# Altium project RTTester_CIV.PrjPcb (part 1 of 2)
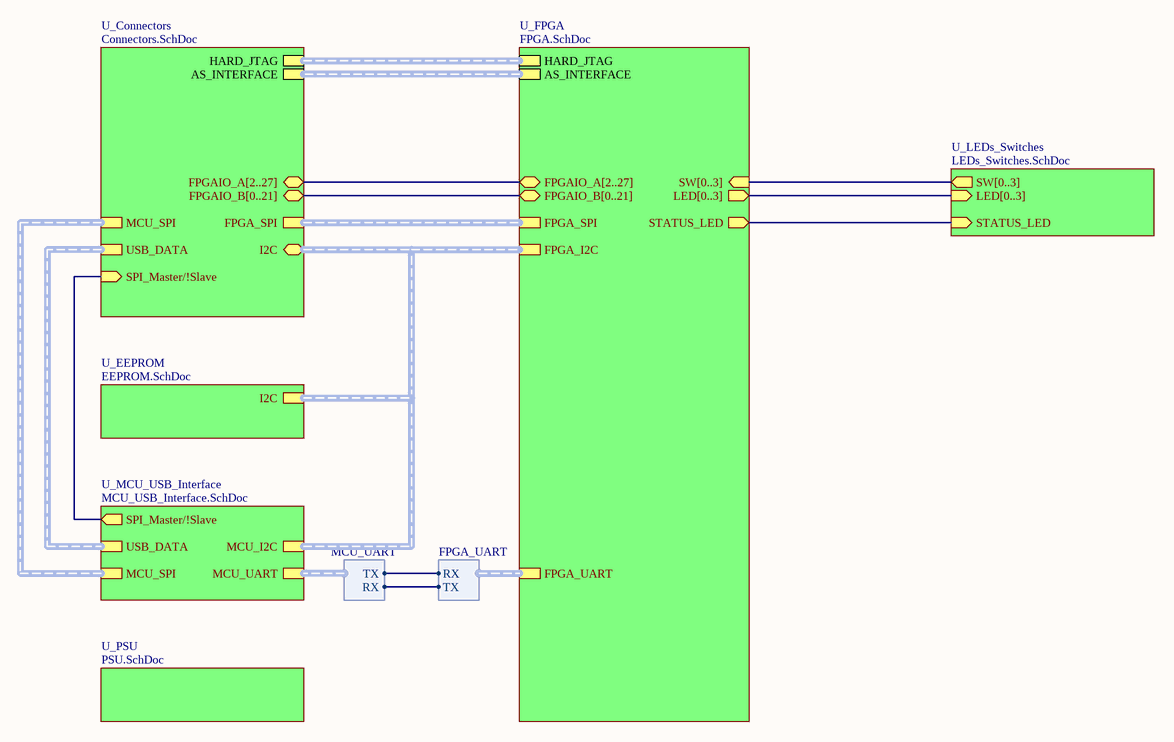
[diagram p0: Top.SchDoc]
18 sheets, 147 parts. Net scope: hierarchical (ports join the sheet entries above them; power ports are global).
Board file: RTTester.PcbDoc
Sheets:
  Top.SchDoc
    U_PSU = PSU.SchDoc
      U_PUS_Decoupling = PUS_Decoupling.SchDoc
      U_PSU_3V3_LD29300 = PSU_3V3_LD29300.SchDoc
      U_PSU_2V5_LDK130 = PSU_2V5_LDK130.SchDoc
      U_PSU_1V2_LD1117A = PSU_1V2_LD1117A.SchDoc
    U_LEDs_Switches = LEDs_Switches.SchDoc
    U_MCU_USB_Interface = MCU_USB_Interface.SchDoc
    U_Connectors = Connectors.SchDoc
      U_Config_Interfaces = Config_Interfaces.SchDoc
      U_MicroSD = MicroSD.SchDoc
    U_FPGA = FPGA.SchDoc
      U_FPGA_Conf = FPGA_Conf.SchDoc
      U_FPGA_CLK = FPGA_CLK.SchDoc
      U_FPGA_Power = FPGA_Power.SchDoc
      U_FPGA_Banks = FPGA_Banks.SchDoc
      U_OSC = OSC.SchDoc
    U_EEPROM = EEPROM.SchDoc

## Sheet Top.SchDoc: TOP
size A4; DocumentNumber: 1; SheetNumber: 1; SheetTotal: 18

### Sub-sheets
U_Connectors = Connectors.SchDoc: HARD_JTAG (harness HARD_JTAG), AS_INTERFACE (harness AS_INTERFACE), FPGAIO_A[2..27] (bidir), FPGAIO_B[0..21] (bidir, harness TEST_INT), USB_DATA (harness USB_DATA), FPGA_SPI (harness FPGA_SPI), MCU_SPI (harness MCU_SPI), I2C (harness I2C), SPI_Master/!Slave (in)
U_EEPROM = EEPROM.SchDoc: I2C (harness I2C)
U_FPGA = FPGA.SchDoc: HARD_JTAG (harness HARD_JTAG), AS_INTERFACE (harness AS_INTERFACE), STATUS_LED (out), FPGA_SPI (harness FPGA_SPI), FPGA_I2C (harness I2C), FPGAIO_A[2..27] (bidir), FPGAIO_B[0..21] (bidir, harness TEST_INT), FPGA_UART (harness FPGA_UART), SW[0..3] (in), LED[0..3] (out)
U_LEDs_Switches = LEDs_Switches.SchDoc: SW[0..3] (out), LED[0..3] (in), STATUS_LED (in)
U_MCU_USB_Interface = MCU_USB_Interface.SchDoc: USB_DATA (harness USB_DATA), MCU_SPI (harness MCU_SPI), MCU_I2C (harness I2C), MCU_UART (harness MCU_UART), SPI_Master/!Slave (out)
U_PSU = PSU.SchDoc: no entries

### Harnesses
MCU_UART: TX, RX
FPGA_UART: TX, RX

### Nets
FPGA_RX: sheet U_MCU_USB_Interface/MCU_UART.TX, sheet U_FPGA/FPGA_UART.RX
FPGA_TX: sheet U_MCU_USB_Interface/MCU_UART.RX, sheet U_FPGA/FPGA_UART.TX
SPI_M/!S: sheet U_MCU_USB_Interface/SPI_Master/!Slave, sheet U_Connectors/SPI_Master/!Slave
NetP8_3: sheet U_LEDs_Switches/STATUS_LED, sheet U_FPGA/STATUS_LED

### Buses and harness runs
bus sheet U_Connectors/FPGAIO_A[2..27] = sheet U_FPGA/FPGAIO_A[2..27]
bus sheet U_FPGA/LED[0..3] = sheet U_LEDs_Switches/LED[0..3]
bus sheet U_FPGA/SW[0..3] = sheet U_LEDs_Switches/SW[0..3]
harness sheet U_Connectors/AS_INTERFACE = sheet U_FPGA/AS_INTERFACE
harness sheet U_Connectors/FPGA_SPI = sheet U_FPGA/FPGA_SPI
harness sheet U_Connectors/HARD_JTAG = sheet U_FPGA/HARD_JTAG
harness sheet U_Connectors/I2C = sheet U_EEPROM/I2C = sheet U_FPGA/FPGA_I2C = sheet U_MCU_USB_Interface/MCU_I2C
harness sheet U_Connectors/MCU_SPI = sheet U_MCU_USB_Interface/MCU_SPI
harness sheet U_Connectors/USB_DATA = sheet U_MCU_USB_Interface/USB_DATA

### Notes on the sheet
- Title
- Size:
- Date:
- A4
- Number:
- Time:
- Revision:
- Sheet
- of
- File:

## Sheet PSU.SchDoc: PSU TOP
size A4; DocumentNumber: 14; SheetNumber: 14; SheetTotal: 18
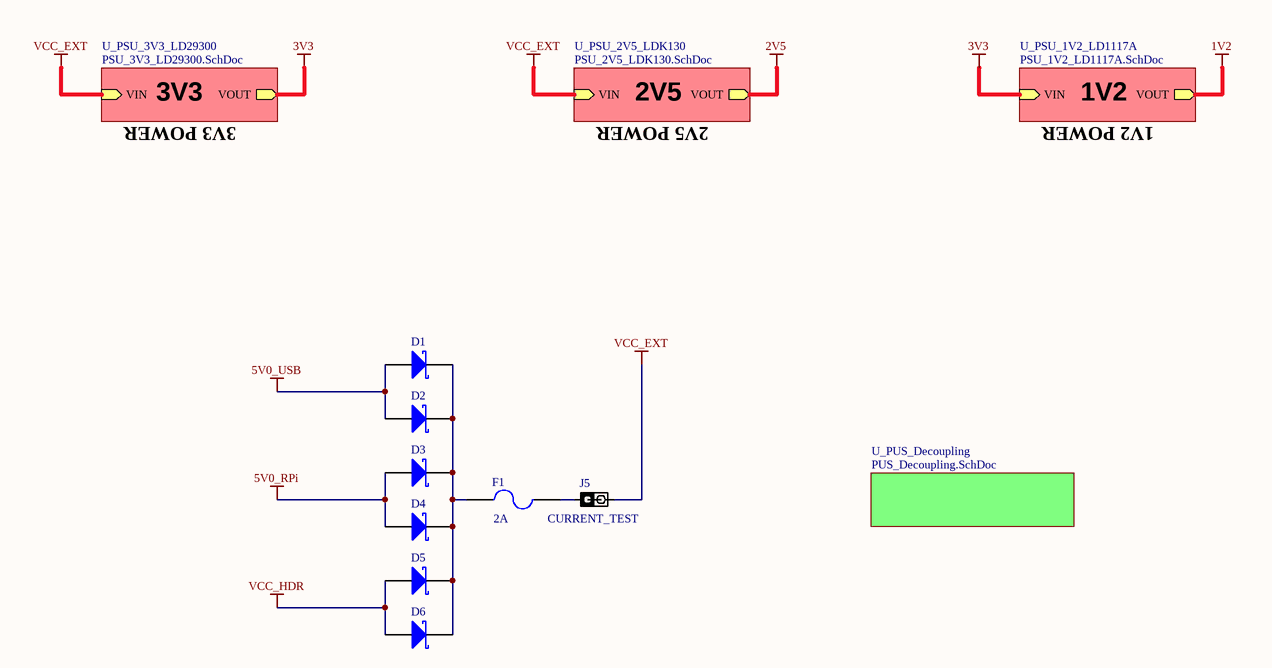
[diagram p1: PSU.SchDoc]

### Parts
D1  D Schottky  [LED-0805-K]  (value not drawn)
D2  D Schottky  [LED-0805-K]  (value not drawn)
D3  D Schottky  [LED-0805-K]  (value not drawn)
D4  D Schottky  [LED-0805-K]  (value not drawn)
D5  D Schottky  [LED-0805-K]  (value not drawn)
D6  D Schottky  [LED-0805-K]  (value not drawn)
F1  Hold Current: 2A  [1812]  (hidden comment: Polyfuse_1812L200THPR)
J5  JMPR2  [JMPR2-CLOSED]  (value not drawn)

### Sub-sheets
U_PSU_1V2_LD1117A = PSU_1V2_LD1117A.SchDoc: VIN (in), VOUT (out)
U_PSU_2V5_LDK130 = PSU_2V5_LDK130.SchDoc: VIN (in), VOUT (out)
U_PSU_3V3_LD29300 = PSU_3V3_LD29300.SchDoc: VIN (in), VOUT (out)
U_PUS_Decoupling = PUS_Decoupling.SchDoc: no entries

### Nets
3V3: sheet U_PSU_3V3_LD29300/VOUT, sheet U_PSU_1V2_LD1117A/VIN
5V0_RPi: D3.A D4.A
5V0_USB: D1.A D2.A
VCC_EXT: J5.2 ; sheet U_PSU_3V3_LD29300/VIN, sheet U_PSU_2V5_LDK130/VIN
VCC_HDR: D5.A D6.A
NetD1_K: D1.K D2.K D3.K D4.K D5.K D6.K F1.1
NetF1_2: F1.2 J5.1

### Notes on the sheet
- 3V3
- 3V3 POWER
- 2V5
- 2V5 POWER
- 1V2
- 1V2 POWER
- CURRENT_TEST
- Title
- Size:
- Date:
- A4
- Number:
- Time:
- Revision:
- Sheet
- of
- File:

### Library data of the parts
D1-D6 = D Schottky: Schottky Diode - SD0805S020S1R0; Published: 8-Jun-2000; LatestRevisionDate: 17-Jul-2002; LatestRevisionNote: Re-released for DXP Platform.; PackageReference: SMB; Publisher: Altium Limited; PackageDescription: 0805; Code_JEDEC: 0805
F1 = Fuse 2: Polyfuse; Trip Current: 3.5A; Published: 8-Jun-2000; LatestRevisionDate: 17-Jul-2002; LatestRevisionNote: Re-released for DXP Platform.; PackageReference: PIN-W2/E2.8; Publisher: Altium Limited; PackageDescription: SMD-1812
J5 = JMPR2-CLOSED: JMPR2 CLOSED BY DEFAULT; Manufacturer: Sullins Connector Solutions; Manufacturer Part Number: PBC36SAAN; Supplier 1: Digi-Key; Supplier Part Number 1: S1011E-36-ND; Reel: Closed

## Sheet PUS_Decoupling.SchDoc: PSU_DECOUPLING
size A4; DocumentNumber: 18; SheetNumber: 18; SheetTotal: 18
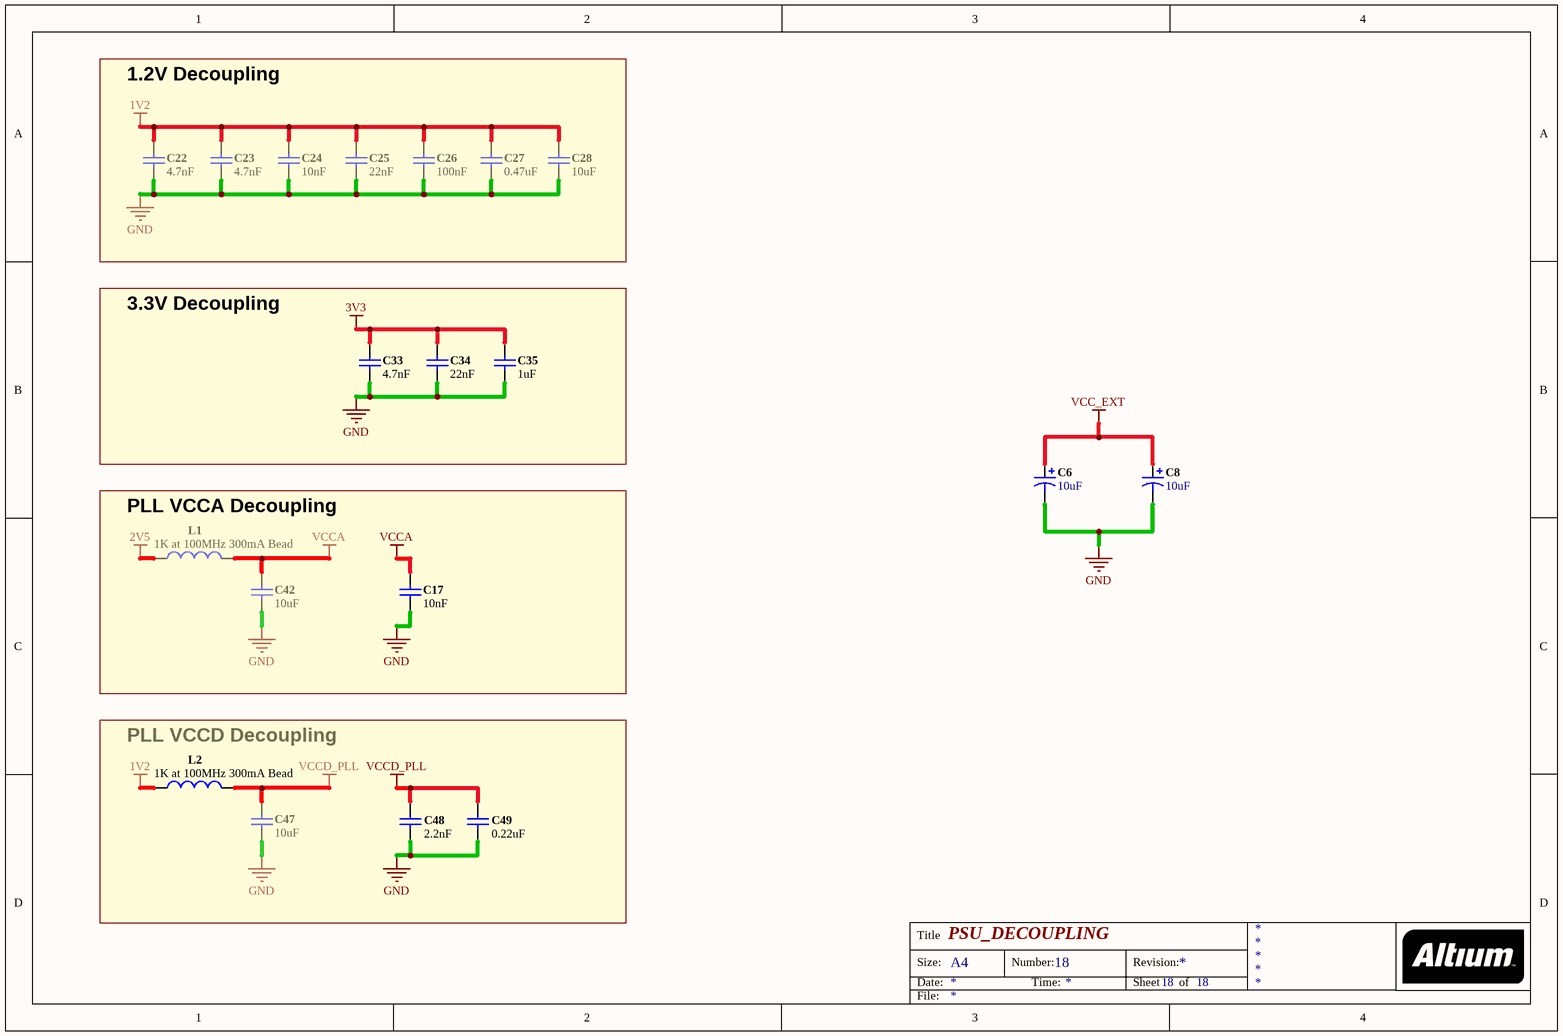
[diagram p2: PUS_Decoupling.SchDoc]

### Parts
C6  10uF  [AVX-CAPC3528_V]
C8  10uF  [AVX-CAPC3528_V]
C17  10nF  [0603C-GENERIC]
C22  4.7nF  [0603C-GENERIC]
C23  4.7nF  [0603C-GENERIC]
C24  10nF  [0603C-GENERIC]
C25  22nF  [0603C-GENERIC]
C26  100nF  [0603C-GENERIC]
C27  0.47uF  [0603C-GENERIC]
C28  10uF  [0603C-GENERIC]
C33  4.7nF  [0603C-GENERIC]
C34  22nF  [0603C-GENERIC]
C35  1uF  [0603C-GENERIC]
C42  10uF  [0805C-GENERIC]
C47  10uF  [0805C-GENERIC]
C48  2.2nF  [0603C-GENERIC]
C49  0.22uF  [0603C-GENERIC]
L1  1K at 100MHz 300mA Bead  [0805FB-1KZ]
L2  1K at 100MHz 300mA Bead  [0805FB-1KZ]

### Blocks framed on the sheet
1.2V Decoupling: C22-C28
3.3V Decoupling: C33-C35
PLL VCCA Decoupling: C17 C42 L1
PLL VCCD Decoupling: C47-C49 L2

### Nets
1V2: C22.1 C23.1 C24.1 C25.1 C26.1 C27.1 C28.1 L2.1
2V5: L1.1
3V3: C33.1 C34.1 C35.1
GND: C6.2 C8.2 C17.1 C22.2 C23.2 C24.2 C25.2 C26.2 C27.2 C28.2 C33.2 C34.2 C35.2 C42.1 C47.1 C48.2 C49.2
VCC_EXT: C6.1 C8.1
VCCA: C17.2 C42.2 L1.2
VCCD_PLL: C47.2 C48.1 C49.1 L2.2

### Notes on the sheet
- Title
- Size:
- Date:
- A4
- Number:
- Time:
- Revision:
- Sheet
- of
- File:

### Library data of the parts
C6 C8 = CMP-0279-00001-1: Capacitor, Tantalum, 10uF 10% 20V MCCT-B (3528); PartNumber: TAJB106K020RNJ; Manufacturer: AVX; Polarity: Polarized; PackageDescription: 2-Pin SMT Capacitor, 3.5 x 2.8 mm Body; ComponentLink1URL: http://www.avx.com/; PackageReference: CAPC3528; ComponentLink2Description: Datasheet; Value: 10uF; Technology: Tantalum; ComponentLink2URL: http://www.avx.com/docs/Catalogs/taj.pdf; Tolerance: 10%; ComponentLink1Description: Manufacturer URL; Rated Voltage: 20V; DatasheetVersion: Jun-13; Mounting Technology: Surface Mount
C17 C22 C23 C33 = CAP 470nF 10V ±10% 0402 (1005 Metric) Thickness 0.6mm SMD: Capacitor, Ceramic, 10% 10V 0603 X7R; Case-Metric: 1005; Case-EIA: 0402; Rated Voltage: 10 V; Max Thickness: 0.6 mm; Technology: SMT; Tolerance: ±10%
  C17: Value: 10nF
  C22 C23 C33: Value: 4.7nF
C24-C27 C34 C35 C48 C49 = CAP 4.7uF 10V ±10% 0603 (1608 Metric) Thickness 0.55mm SMD: Capacitor, Ceramic, 10% 10V 0603 X7R; Case-Metric: 1608; Case-EIA: 0603; Rated Voltage: 10 V; Technology: SMT; Max Thickness: 0.55 mm; Tolerance: ±10%
  C24: Value: 10nF
  C25 C34: Value: 22nF
  C26: Value: 100nF
  C27: Value: 0.47uF
  C35: Value: 1uF
  C48: Value: 2.2nF
  C49: Value: 0.22uF
C28 = CAP 4.7uF 10V ±10% 0603 (1608 Metric) Thickness 0.55mm SMD: Capacitor, Ceramic, 10% 10V 0603 X7R; Case-Metric: 1608; Case-EIA: 0805; Rated Voltage: 10 V; Technology: SMT; Max Thickness: 0.55 mm; Tolerance: ±10%; Value: 10uF
C42 C47 = CAP 470nF 10V ±10% 0402 (1005 Metric) Thickness 0.6mm SMD: Capacitor, Ceramic, 10% 10V 0805 X7R; Case-Metric: 1005; Case-EIA: 0402; Rated Voltage: 10 V; Value: 10uF; Max Thickness: 0.6 mm; Technology: SMT; Tolerance: ±10%
L1 L2 = D-102-0026: Inductor, Ferrite Bead 1K@100MHz 300mA 0805 BK1005HS102-T; Inductance: nH; Max Input Current: 300 mA; Mounting Technology: Surface Mount; Status: Production; Category: Inductor

## Sheet PSU_3V3_LD29300.SchDoc: PSU 3V3
size A4; DocumentNumber: 17; SheetNumber: 17; SheetTotal: 18
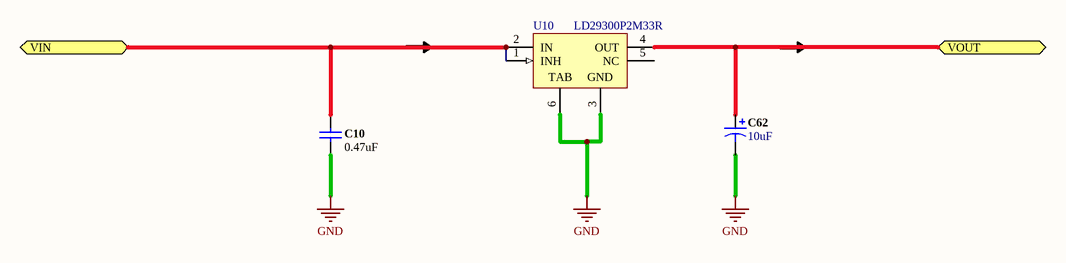
[diagram p3: PSU_3V3_LD29300.SchDoc]

### Parts
C10  0.47uF  [0805C-GENERIC]
C62  10uF  [AVX-CAPC3528_V]
U10  LD29300P2M33R  [P2PAK/A_N]

### Ports
VIN, VOUT

### Nets
3V3: C62.1 U10.4(OUT) ; port VOUT
GND: C10.2 C62.2 U10.3(GND) U10.6(TAB)
VCC_EXT: C10.1 U10.1(INH) U10.2(IN) ; port VIN

Not connected (* = marked no-connect by the designer): U10 5(NC)

### Notes on the sheet
- Title
- Size:
- Date:
- A4
- Number:
- Time:
- Revision:
- Sheet
- of
- File:

### Library data of the parts
C10 = D-101-0027: Capacitor, Ceramic, 10% 10V 0805 X7R; Polarity: Non-Polarized; Capacitance: 0.47uF; Dielectric: X7R; Mounting Technology: Surface Mount; Rated Voltage: 10 V; Status: Production; Technology: Ceramic; Tolerance: 10 %; Category: Capacitor
C62 = CMP-0279-00001-1: Capacitor, Tantalum, 10uF 10% 20V MCCT-B (3528) - TAJB106K020RNJ; Manufacturer: AVX; Polarity: Polarized; PartNumber: TAJB106K020RNJ; PackageDescription: 2-Pin SMT Capacitor, 3.5 x 2.8 mm Body; ComponentLink1URL: http://www.avx.com/; PackageReference: CAPC3528; ComponentLink2Description: Datasheet; Value: 10uF; Technology: Tantalum; ComponentLink2URL: http://www.avx.com/docs/Catalogs/taj.pdf; Tolerance: 10%; ComponentLink1Description: Manufacturer URL; Rated Voltage: 20V; DatasheetVersion: Jun-13; Mounting Technology: Surface Mount
U10 = LD29300P2M33R: 3A, Very Low-Drop Voltage Regulators, 3.3V, 6-Pin P2PAK/A; DatasheetVersion: Jul-2008; PackageVersion: 2008; PackageReference: P2PAK/A; PackageDescription: 6-Pin Transistor Outline Package 1.7 mm Pitch, 15.4 mm Lead Span; PartNumber: LD29300P2M33R; ComponentLink1Description: Manufacturer URL; ComponentLink1URL: http://www.st.com; ComponentLink2Description: Datasheet; ComponentLink2URL: http://www.st.com/internet/com/TECHNICAL_RESOURCES/TECHNICAL_LITERATURE/DATASHEET/CD00003208.pdf

## Sheet PSU_2V5_LDK130.SchDoc: PSU 2V5
size A4; DocumentNumber: 16; SheetNumber: 16; SheetTotal: 18
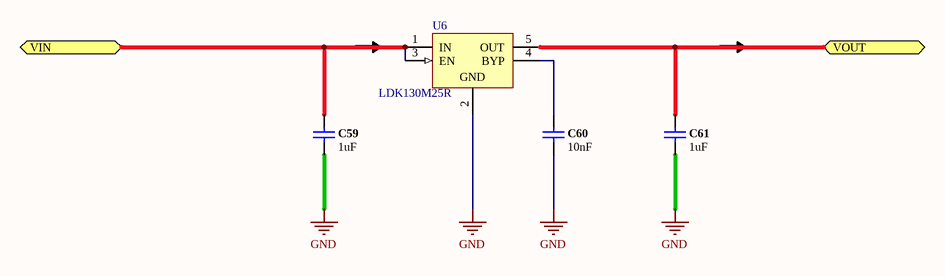
[diagram p4: PSU_2V5_LDK130.SchDoc]

### Parts
C59  1uF  [0805C-GENERIC]
C60  10nF  [0805C-GENERIC]
C61  1uF  [0805C-GENERIC]
U6  LDK130M25R  [SOT23-5L_N]

### Ports
VIN, VOUT

### Nets
2V5: C61.1 U6.5(OUT) ; port VOUT
GND: C59.2 C60.2 C61.2 U6.2(GND)
VCC_EXT: C59.1 U6.1(IN) U6.3(EN) ; port VIN
NetC60_1: C60.1 U6.4(BYP)

### Notes on the sheet
- Title
- Size:
- Date:
- A4
- Number:
- Time:
- Revision:
- Sheet
- of
- File:

### Library data of the parts
C59-C61 = D-101-0027: as C10 on sheet PSU_3V3_LD29300; Dielectric: X7R; Mounting Technology: Surface Mount; Rated Voltage: 10 V; Status: Production; Technology: Ceramic; Tolerance: 10 %; Category: Capacitor
  C59 C61: Capacitance: 1uF
  C60: Capacitance: 10nF
U6 = LD2985BM25R: 300mA, Very-Low Drop and Low Noise Voltage Regulator Low ESR Capacitors Compatible, with Inhibit Function, 2.5V, 5-Pin SOT23-5L; PackageVersion: 2008; PackageReference: SOT23-5L; PackageDescription: 5-Pin SOT-23 Package, 2.9 x 1.6 mm Body, 0.95 mm Pitch, 2.8 mm Lead Span; PartNumber: LDK130M25R; ComponentLink1Description: Manufacturer URL; ComponentLink1URL: http://www.st.com

## Sheet PSU_1V2_LD1117A.SchDoc: PSU 1V2
size A4; DocumentNumber: 15; SheetNumber: 15; SheetTotal: 18
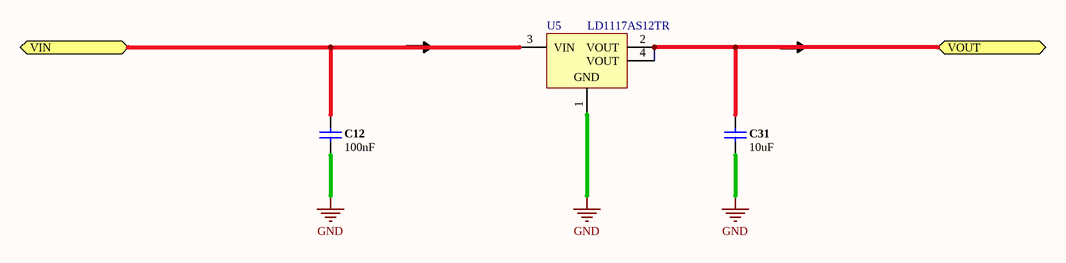
[diagram p5: PSU_1V2_LD1117A.SchDoc]

### Parts
C12  100nF  [0805C-GENERIC]
C31  10uF  [0805C-GENERIC]
U5  LD1117AS12TR  [SOT-223_N]

### Ports
VIN, VOUT

### Nets
1V2: C31.1 U5.2(VOUT) U5.4(VOUT) ; port VOUT
3V3: C12.1 U5.3(VIN) ; port VIN
GND: C12.2 C31.2 U5.1(GND)

### Notes on the sheet
- Title
- Size:
- Date:
- A4
- Number:
- Time:
- Revision:
- Sheet
- of
- File:

### Library data of the parts
C12 = D-101-0027: Capacitor, Ceramic, 10% 10V 0603 X7R; Polarity: Non-Polarized; Capacitance: 100nF; Dielectric: X7R; Mounting Technology: Surface Mount; Rated Voltage: 10 V; Status: Production; Technology: Ceramic; Tolerance: 10 %; Category: Capacitor
C31 = D-101-0027: as C10 on sheet PSU_3V3_LD29300; Capacitance: 10uF; Dielectric: X7R; Mounting Technology: Surface Mount; Rated Voltage: 10 V; Status: Production; Technology: Ceramic; Tolerance: 10 %; Category: Capacitor
U5 = LD1117AS12TR: 1A, Low Drop Positive Voltage Regulator, 1.2V, 4-Pin SOT-223, Tape and Reel; DatasheetVersion: Dec-2011; PackageVersion: 2010; PackageReference: SOT-223; PackageDescription: 4-Pin SOT-223 Package, 6.5 x 3.5 mm Body, 2.3 mm Pitch, 7 mm Lead Span; PartNumber: LD1117AS12TR; ComponentLink1Description: Manufacturer URL; ComponentLink1URL: http://www.st.com; ComponentLink2Description: Datasheet; ComponentLink2URL: http://www.st.com/internet/com/TECHNICAL_RESOURCES/TECHNICAL_LITERATURE/DATASHEET/CD00002116.pdf

## Sheet LEDs_Switches.SchDoc: LEDs AND SWITCHES
size A4; DocumentNumber: 12; SheetNumber: 12; SheetTotal: 18
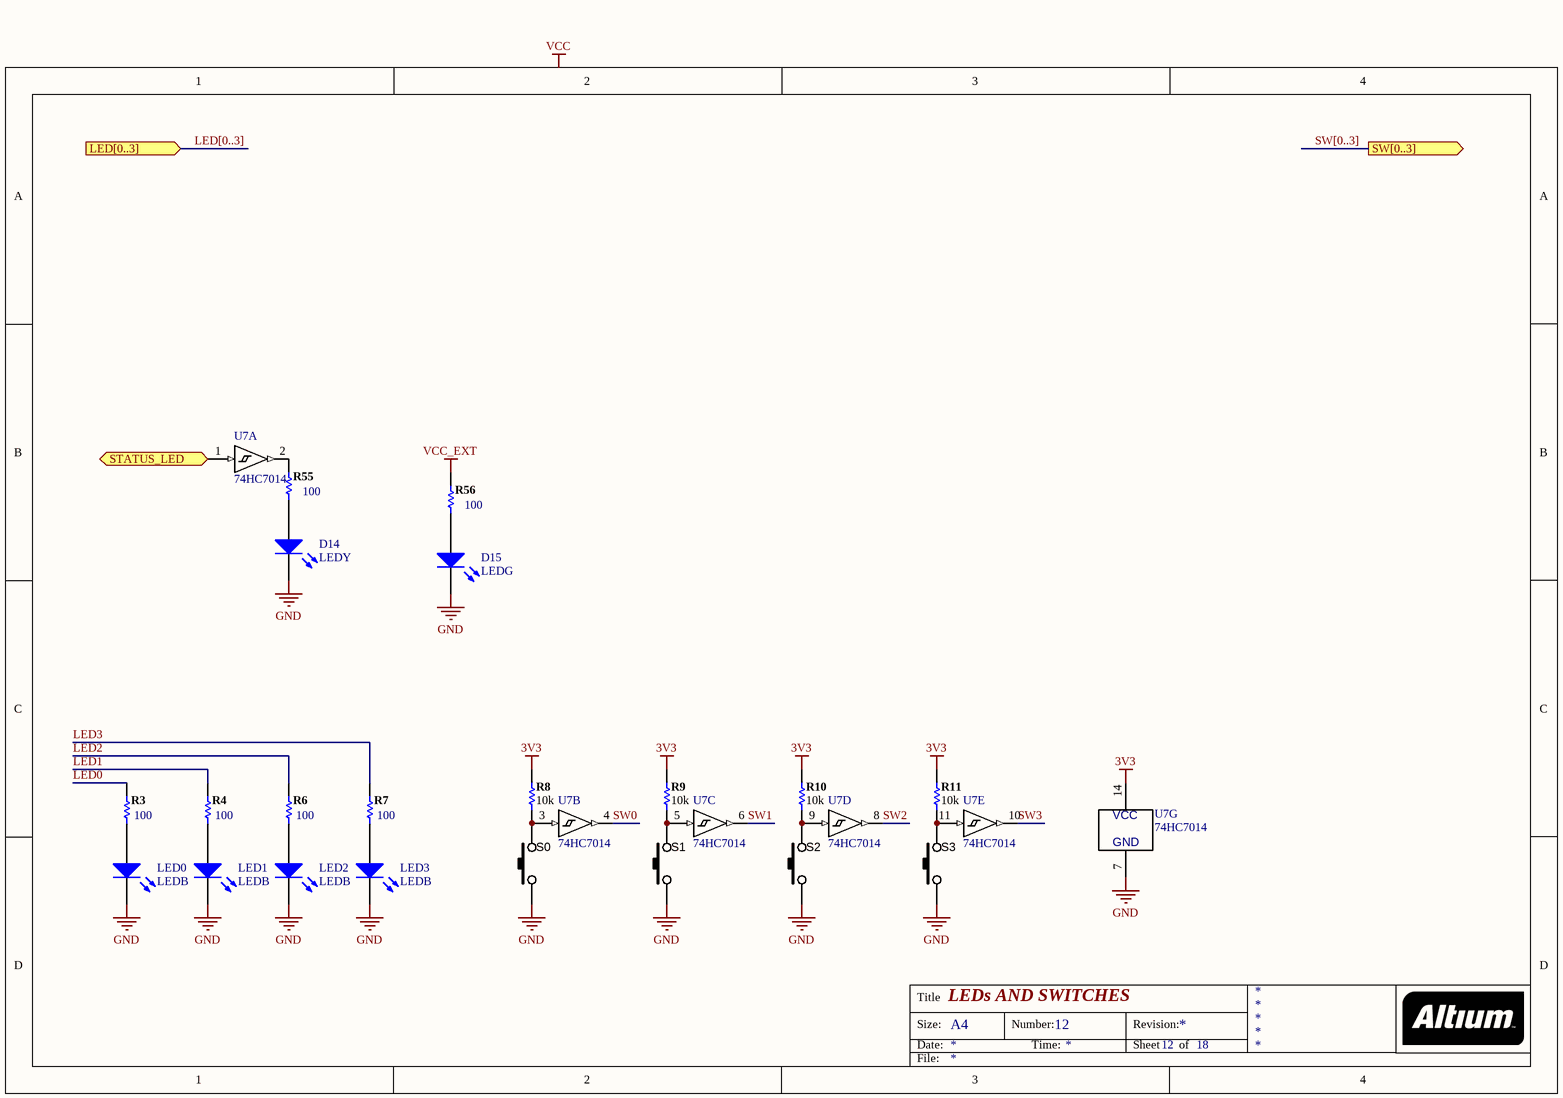
[diagram p6: LEDs_Switches.SchDoc]

### Parts
D14  LEDY  [LED-0805-K]
D15  LEDG  [LED-0805-K]
LED0  LEDB  [LED-0805-K]
LED1  LEDB  [LED-0805-K]
LED2  LEDB  [LED-0805-K]
LED3  LEDB  [LED-0805-K]
R3  100  [0805R-100]
R4  100  [0805R-100]
R6  100  [0805R-100]
R7  100  [0805R-100]
R8  10k  [0805R-10K]
R9  10k  [0805R-10K]
R10  10k  [0805R-10K]
R11  10k  [0805R-10K]
R55  100  [0805R-100]
R56  100  [0805R-100]
S0  EVQ-PQHB55  [TACT-SWITCH-TS1150]  (value not drawn)
S1  EVQ-PQHB55  [TACT-SWITCH-TS1150]  (value not drawn)
S2  EVQ-PQHB55  [TACT-SWITCH-TS1150]  (value not drawn)
S3  EVQ-PQHB55  [TACT-SWITCH-TS1150]  (value not drawn)
U7  74HC7014  [SO14]  (parts A,B,C,D,E,G of 7)

### Ports
LED[0..3] (in), STATUS_LED (in), SW[0..3] (out)

### Nets
3V3: R8.2 R9.2 R10.2 R11.2 U7.14(VCC)
GND: D14.K D15.K LED0.K LED1.K LED2.K LED3.K S0.1 S1.1 S2.1 S3.1 U7.7(GND)
VCC_EXT: R56.2
LED0: R3.2
LED1: R4.2
LED2: R6.2
LED3: R7.2
SW0: U7.4(Y)
SW1: U7.6(Y)
SW2: U7.8(Y)
SW3: U7.10(Y)
NetD14_A: D14.A R55.1
NetD15_A: D15.A R56.1
NetLED0_A: LED0.A R3.1
NetLED1_A: LED1.A R4.1
NetLED2_A: LED2.A R6.1
NetLED3_A: LED3.A R7.1
NetP8_3: U7.1(A) ; port STATUS_LED
NetR8_1: R8.1 S0.2 U7.3(A)
NetR9_1: R9.1 S1.2 U7.5(A)
NetR10_1: R10.1 S2.2 U7.9(A)
NetR11_1: R11.1 S3.2 U7.11(A)
NetR55_2: R55.2 U7.2(Y)

### Buses and harness runs
bus LED[0..3] = port LED[0..3]
bus SW[0..3] = port SW[0..3]

### Notes on the sheet
- Labels drawn without touching a wire or pin: VCC
- Title
- Size:
- Date:
- A4
- Number:
- Time:
- Revision:
- Sheet
- of
- File:

### Library data of the parts
D14 D15 = LED2: Typical RED, GREEN, YELLOW, AMBER GaAs LED; Published: 8-Jun-2000; LatestRevisionDate: 17-Jul-2002; LatestRevisionNote: Re-released for DXP Platform.; PackageVersion: Feb-2002; PackageReference: 3.2X1.6X1.1; Publisher: Altium Limited; PackageDescription: SM LED; 2 Flat Leads
LED0-LED3 = LED2: Typical BLUE GaAs LED; Published: 8-Jun-2000; LatestRevisionDate: 17-Jul-2002; LatestRevisionNote: Re-released for DXP Platform.; PackageVersion: Feb-2002; PackageReference: 3.2X1.6X1.1; Publisher: Altium Limited; PackageDescription: SM LED; 2 Flat Leads
R3 R4 R6-R11 R55 R56 = D-100-0116: Tolerance: 1 %; Mounting Technology: Surface Mount; Status: Production; Category: Resistor
  R3 R4 R6 R7 R55 R56: Value: 100
  R8-R11: Value: 10k
S0-S3 = SW_EVQ-PQHB55: Low-profile captive tact switch; Manufacturer 1: Panasonic - ECG; Ratings: 1.6 Newton; Switch Function: Off-Mom; Contact Rating @ Voltage: 0.02A @ 15VDC; Outline: 4.50mm x 4.50mm; Operating Force: 160gf; SCDType: spec; Function: On/Off; Package / Case: per dwg; Supplier 1: Digi-Key; Supplier Part Number 1: P8090SCT-ND; Mounting Type: Surface Mount; Orientation: Vertical; ComponentLink1URL: http://industrial.panasonic.com/www-data/pdf/ATK0000/ATK0000CE1.pdf; ComponentLink1Description: http://industrial.panasonic.com/www-data/pdf/ATK0000/ATK0000CE1.pdf; Manufacturer Part Number 1: EVQ-PQHB55
U7 = 74HC7014: IC, Hex Schmitttrigger Buffer, SO-14

## Sheet MCU_USB_Interface.SchDoc: MCU USB INTERFACE
size A4; DocumentNumber: 13; SheetNumber: 13; SheetTotal: 18
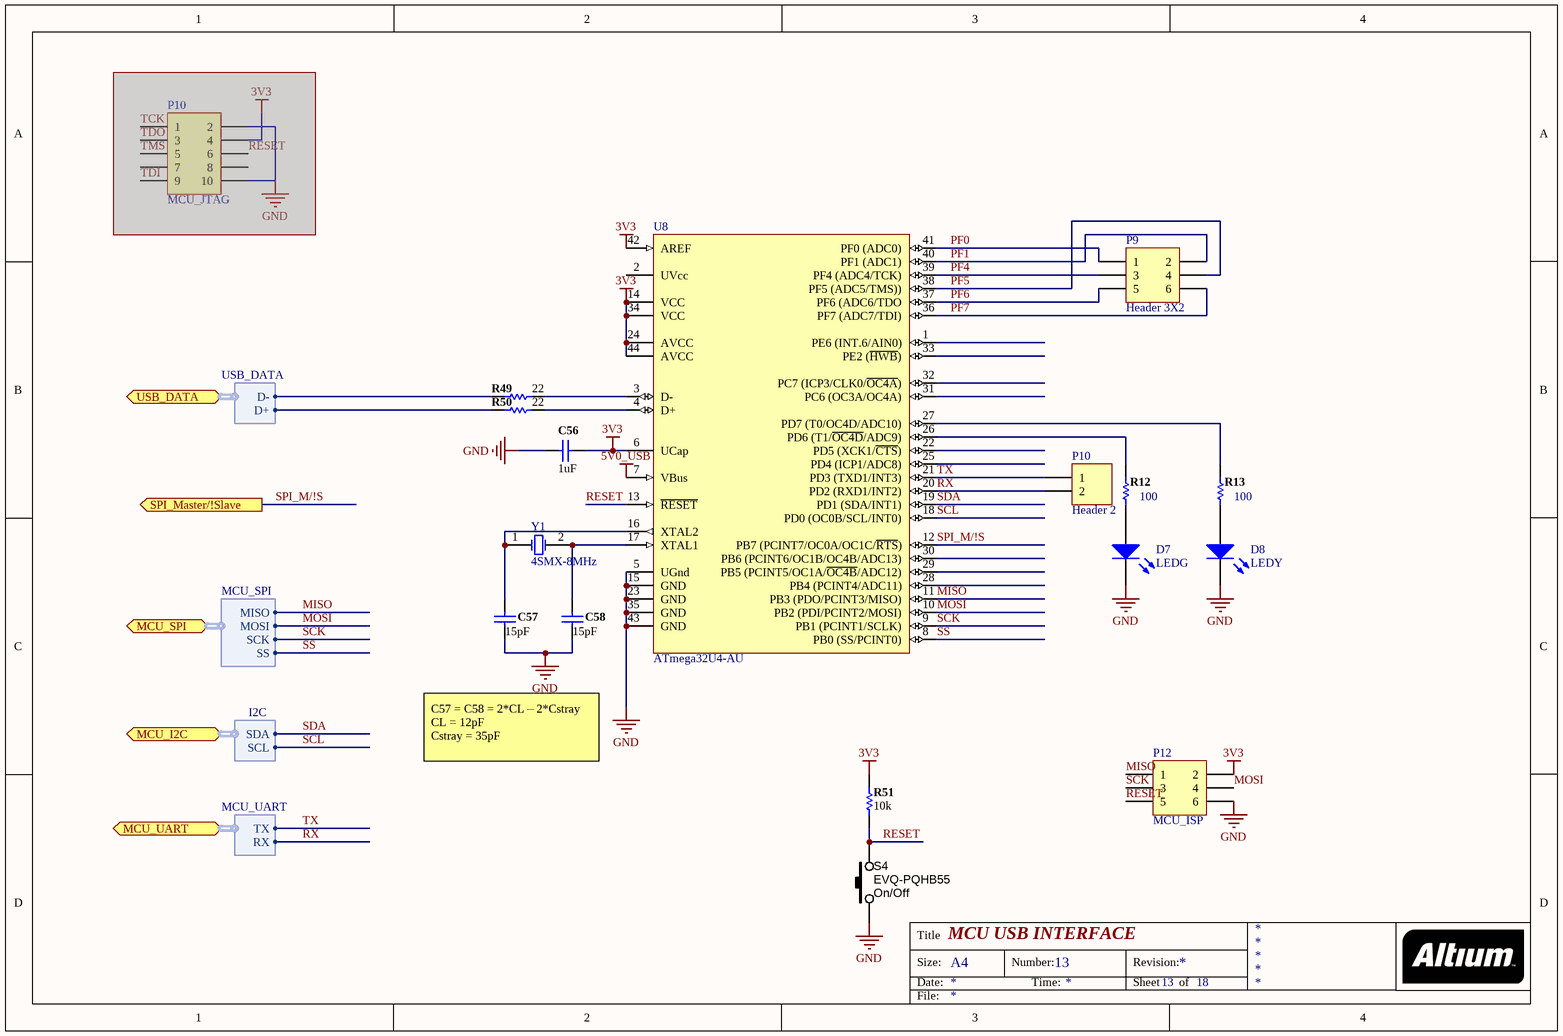
[diagram p7: MCU_USB_Interface.SchDoc]

### Parts
(Parts that share a designator on the sheet are numbered #1, #2 ... from top to bottom, then left to right.)
C56  1uF  [0805C-GENERIC]
C57  15pF  [0805C-GENERIC]
C58  15pF  [0805C-GENERIC]
D7  LEDG  [LED-0805-K]
D8  LEDY  [LED-0805-K]
P9  Header 3X2  [HDR2X3]
P10#1  MCU_JTAG  [10P_PCB_HEADER_BRD_MNT]  (masked out: inside a compile mask, not in the netlist)
P10#2  Header 2  [HEADER-1X2]
P12  Header 3X2  [HDR2X3]  (value not drawn)
R12  100  [0805R-100]
R13  100  [0805R-100]
R49  22  [0805R-22]
R50  22  [0805R-22]
R51  10k  [0805R-10K]
S4  Function: On/Off  [TACT-SWITCH-TS1150]  (hidden comment: EVQ-PQHB55)
U8  ATmega32U4-AU  [44ML_N]
Y1  4SMX-8MHz  [4SMX]

### Ports
MCU_I2C (harness I2C), MCU_SPI (harness MCU_SPI), MCU_UART (harness MCU_UART), SPI_Master/!Slave (out), USB_DATA (harness USB_DATA)

### Harnesses
USB_DATA: D-, D+
MCU_SPI: MISO, MOSI, SCK, SS
I2C: SDA, SCL
MCU_UART: TX, RX

### Nets
3V3: C56.2 P12.2 R51.2 U8.6(UCap) U8.14(VCC) U8.24(AVCC) U8.34(VCC) U8.42(AREF) U8.44(AVCC)
5V0_USB: U8.7(VBus)
GND: C56.1 C57.1 C58.1 D7.K D8.K P12.6 S4.1 U8.5(UGnd) U8.15(GND) U8.23(GND) U8.35(GND) U8.43(GND)
MISO: P12.1 U8.11(PB3_(PDO/PCINT3/MISO)) ; port MCU_SPI.MISO
MOSI: P12.4 U8.10(PB2_(PDI/PCINT2/MOSI)) ; port MCU_SPI.MOSI
PF0: P9.1 U8.41(PF0_(ADC0))
PF1: P9.2 U8.40(PF1_(ADC1))
PF4: P9.3 U8.39(PF4_(ADC4/TCK))
PF5: P9.4 U8.38(PF5_(ADC5/TMS)))
PF6: P9.5 U8.37(PF6_(ADC6/TDO)
PF7: P9.6 U8.36(PF7_(ADC7/TDI))
RESET: P12.5 R51.1 S4.2 U8.13(~{RESET})
RX: P10#2.2 U8.20(PD2_(RXD1/INT2)) ; port MCU_UART.RX  [project net FPGA_TX]
SCK: P12.3 U8.9(PB1_(PCINT1/SCLK)) ; port MCU_SPI.SCK
SCL: U8.18(PD0_(OC0B/SCL/INT0)) ; port MCU_I2C.SCL  [project net FPGA_SCL]
SDA: U8.19(PD1_(SDA/INT1)) ; port MCU_I2C.SDA  [project net FPGA_SDA]
SPI_M/!S: U8.12(PB7_(PCINT7/OC0A/OC1C/~{RTS})) ; port SPI_Master/!Slave
SS: U8.8(PB0_(SS/PCINT0)) ; port MCU_SPI.SS
TX: P10#2.1 U8.21(PD3_(TXD1/INT3)) ; port MCU_UART.TX  [project net FPGA_RX]
NetC57_2: C57.2 U8.16(XTAL2) Y1.1(OSC1)
NetC58_2: C58.2 U8.17(XTAL1) Y1.2(OSC2)
NetD7_A: D7.A R12.1
NetD8_A: D8.A R13.1
NetJ6_2: R49.1 ; port USB_DATA.D-
NetJ6_3: R50.1 ; port USB_DATA.D+
NetR12_2: R12.2 U8.26(PD6_(T1/~{OC4D}/ADC9))
NetR13_2: R13.2 U8.27(PD7_(T0/OC4D/ADC10))
NetR49_2: R49.2 U8.3(D-)
NetR50_2: R50.2 U8.4(D+)

Not connected (* = marked no-connect by the designer): U8 1(PE6_(INT.6/AIN0)) 2(UVcc) 22(PD5_(XCK1/~{CTS})) 25(PD4_(ICP1/ADC8)) 28(PB4_(PCINT4/ADC11)) 29(PB5_(PCINT5/OC1A/~{OC4B}/ADC12)) 30(PB6_(PCINT6/OC1B/OC4B/ADC13)) 31(PC6_(OC3A/OC4A)) 32(PC7_(ICP3/CLK0/~{OC4A})) 33(PE2_(~{HWB}))

### Notes on the sheet
- C57 = C58 = 2*CL – 2*Cstray
  CL = 12pF
  Cstray = 35pF
- (near P12) MCU_ISP
- Title
- Size:
- Date:
- A4
- Number:
- Time:
- Revision:
- Sheet
- of
- File:

### Library data of the parts
C56-C58 = D-101-0027: as C10 on sheet PSU_3V3_LD29300; Dielectric: X7R; Mounting Technology: Surface Mount; Rated Voltage: 10 V; Status: Production; Technology: Ceramic; Tolerance: 10 %; Category: Capacitor
  C56: Capacitance: 1uF
  C57 C58: Capacitance: 15pF
D7 D8 = LED2: as D14 on sheet LEDs_Switches; Published: 8-Jun-2000; LatestRevisionDate: 17-Jul-2002; LatestRevisionNote: Re-released for DXP Platform.; PackageVersion: Feb-2002; PackageReference: 3.2X1.6X1.1; Publisher: Altium Limited; PackageDescription: SM LED; 2 Flat Leads
P9 P12 = Header 3X2: Header, 3-Pin, Dual row; LatestRevisionDate: 17-Jul-2002; LatestRevisionNote: Re-released for DXP Platform.; Publisher: Altium Limited
P10#1 = Header 5X2: Header, 5-Pin, Dual row; LatestRevisionDate: 17-Jul-2002; LatestRevisionNote: Re-released for DXP Platform.; Publisher: Altium Limited
P10#2 = Header 2: Header, 2-Pin; LatestRevisionDate: 17-Jul-2002; LatestRevisionNote: Re-released for DXP Platform.; Publisher: Altium Limited
R12 R13 R49-R51 = D-100-0116: Tolerance: 1 %; Mounting Technology: Surface Mount; Status: Production; Category: Resistor
  R12 R13: Value: 100
  R49 R50: Value: 22
  R51: Value: 10k
S4 = SW_EVQ-PQHB55: Low-profile captive tact switch; Manufacturer 1: Panasonic - ECG; Ratings: 1.6 Newton; Switch Function: Off-Mom; Contact Rating @ Voltage: 0.02A @ 15VDC; Outline: 4.50mm x 4.50mm; Operating Force: 160gf; SCDType: spec; Package / Case: per dwg; Supplier 1: Digi-Key; Supplier Part Number 1: P8090SCT-ND; Mounting Type: Surface Mount; Orientation: Vertical; ComponentLink1URL: http://industrial.panasonic.com/www-data/pdf/ATK0000/ATK0000CE1.pdf; ComponentLink1Description: http://industrial.panasonic.com/www-data/pdf/ATK0000/ATK0000CE1.pdf; Manufacturer Part Number 1: EVQ-PQHB55
U8 = ATmega32U4-AU: 8-bit AVR Microcontroller, 2.7-5.5V, 16MHz, 32KB Flash, 1KB EEPROM, 2.5KB SRAM, USB Controller, 44-pin TQFP, Industrial Grade (-40°C to 85°C), Ext Osc; DatasheetVersion: revF, Nov-2010; PackageVersion: rev.G, Jul-2007; PackageReference: 44ML; PackageDescription: 44-Pin Plastic Thin Quad Flat Pack, 10 x 10 x 1.0 mm Body, 0.8 mm Pitch (TQFP); ComponentLink1Description: Manufacturer URL; ComponentLink1URL: http://www.atmel.com/; ComponentLink2Description: ATmega16U4/32U4 Datasheet; ComponentLink2URL: http://www.atmel.com/dyn/resources/prod_documents/doc7766.pdf; ComponentLink3Description: ATmega16U4 ATmega32U4 Summary; ComponentLink3URL: http://www.atmel.com/dyn/resources/prod_documents/7766S.pdf
Y1 = 4SMX: Surface Mount Quartz Crystal; Note: PCB layout complies with manufacturer's recommendation.; Published: 17-Jul-2002; DatasheetDocument: 9-Sep-1999; PackageDocument: 9-Sep-1999; PackageReference: 4SMX; Publisher: Altium Limited; ComponentLink1Description: Manufacturer Link; ComponentLink1URL: http://www.cmac.com/mt/

## Sheet Connectors.SchDoc: CONNECTORS
size A4; DocumentNumber: 2; SheetNumber: 2; SheetTotal: 18
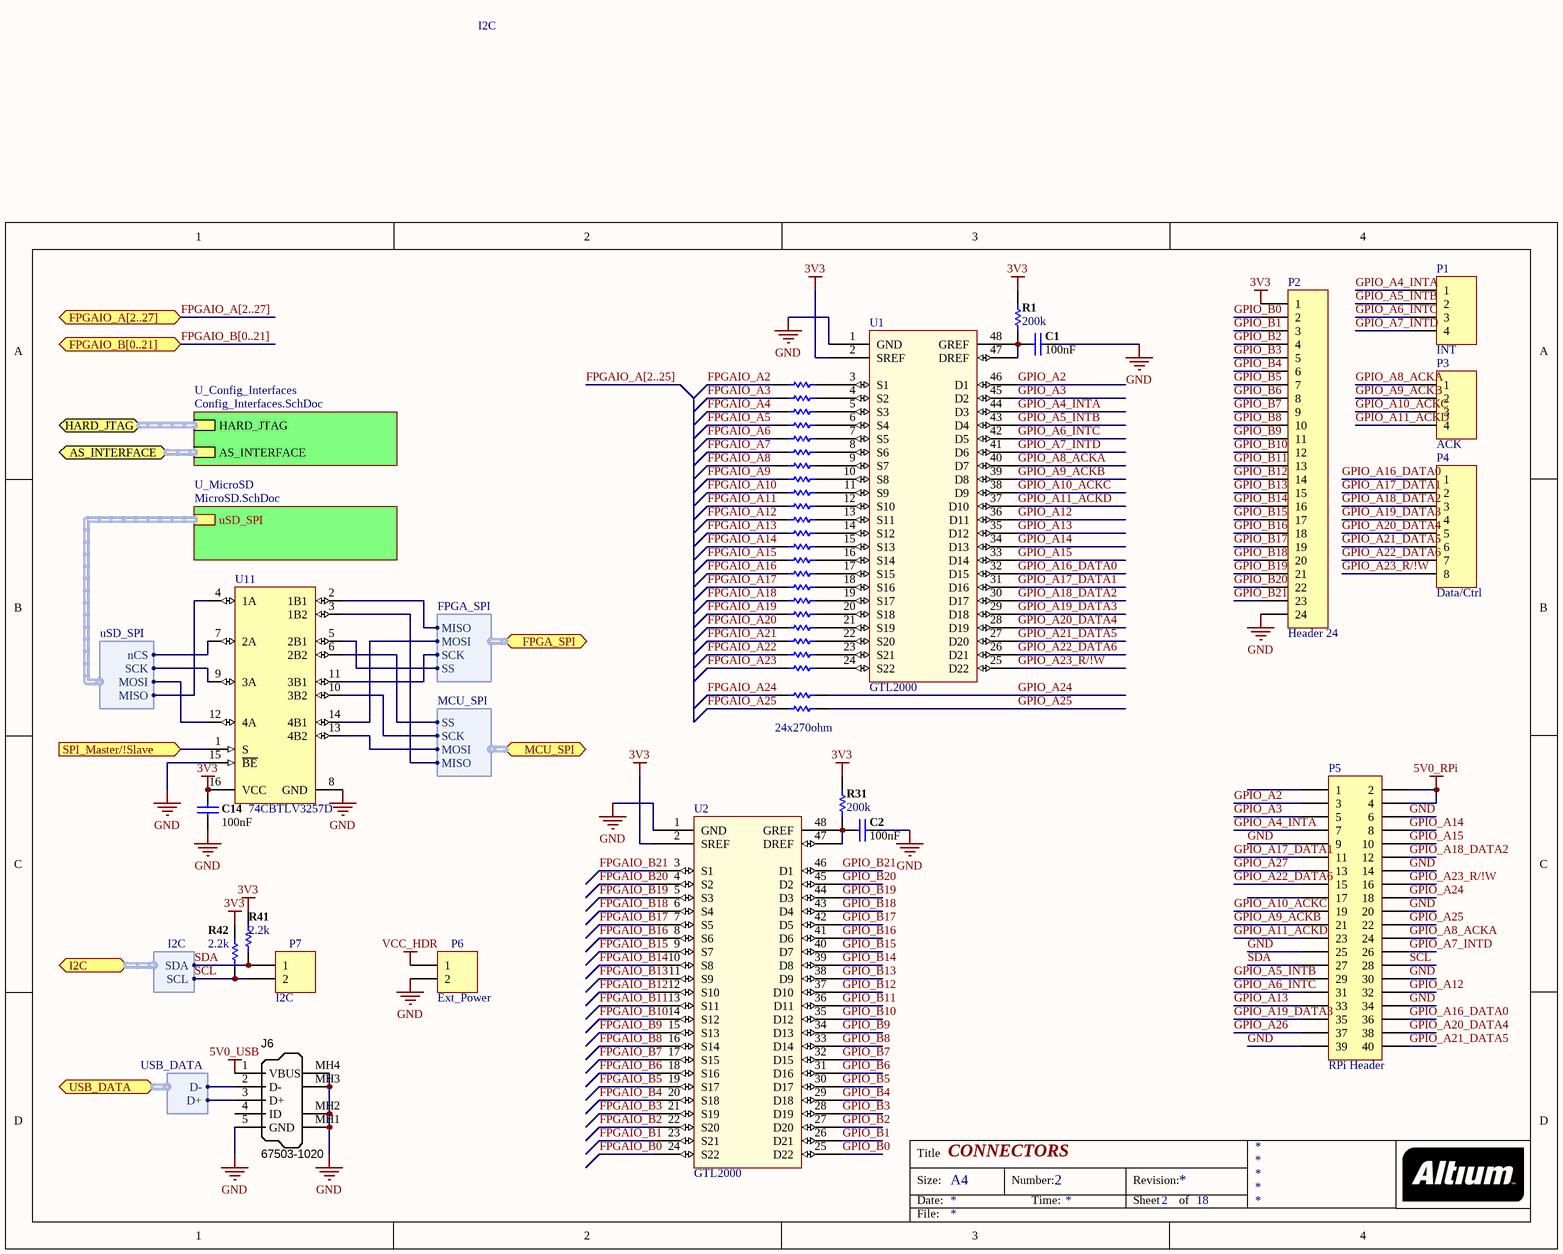
[diagram p8: Connectors.SchDoc]

### Parts
C1  100nF  [0805C-GENERIC]
C2  100nF  [0805C-GENERIC]
C14  100nF  [0805C-GENERIC]
J6  Manufacturer Part Number 1: 67503-1020  [USB_Mini-B_Molex_SMT]  (hidden comment: USB_Mini-B)
P1  Header 4  [HEADER-1X4]  (value not drawn)
P2  Header 24  [HDR1X24]
P3  Header 4  [HEADER-1X4]  (value not drawn)
P4  Header 8  [HEADER-1X8]  (value not drawn)
P5  Header 20X2  (value not drawn)
P6  Header 2  [Connector Molex 2]  (value not drawn)
P7  Header 2  [HEADER-1X2]  (value not drawn)
R1  200k  [0805R-220K]
R2  270  [0805R-270]  (value not drawn)
R5  270  [0805R-270]  (value not drawn)
R14  270  [0805R-270]  (value not drawn)
R15  270  [0805R-270]  (value not drawn)
R16  270  [0805R-270]  (value not drawn)
R17  270  [0805R-270]  (value not drawn)
R18  270  [0805R-270]  (value not drawn)
R19  270  [0805R-270]  (value not drawn)
R20  270  [0805R-270]  (value not drawn)
R21  270  [0805R-270]  (value not drawn)
R22  270  [0805R-270]  (value not drawn)
R23  270  [0805R-270]  (value not drawn)
R24  270  [0805R-270]  (value not drawn)
R25  270  [0805R-270]  (value not drawn)
R26  270  [0805R-270]  (value not drawn)
R27  270  [0805R-270]  (value not drawn)
R28  270  [0805R-270]  (value not drawn)
R29  270  [0805R-270]  (value not drawn)
R30  270  [0805R-270]  (value not drawn)
R31  200k  [0805R-220K]
R35  270  [0805R-270]  (value not drawn)
R36  270  [0805R-270]  (value not drawn)
R37  270  [0805R-270]  (value not drawn)
R38  270  [0805R-270]  (value not drawn)
R39  270  [0805R-270]  (value not drawn)
R41  2.2k  [0805R-0R1]
R42  2.2k  [0805R-0R1]
U1  GTL2000  [TSSOP50P810X120-48N]
U2  GTL2000  [TSSOP50P810X120-48N]
U11  74CBTLV3257D  [SO16]

### Sub-sheets
U_Config_Interfaces = Config_Interfaces.SchDoc: HARD_JTAG (harness HARD_JTAG), AS_INTERFACE (harness AS_INTERFACE)
U_MicroSD = MicroSD.SchDoc: uSD_SPI (harness uSD_SPI)

### Ports
AS_INTERFACE (harness AS_INTERFACE), FPGA_SPI (harness FPGA_SPI), FPGAIO_A[2..27] (bidir), FPGAIO_B[0..21] (bidir, harness TEST_INT), HARD_JTAG (harness HARD_JTAG), I2C (harness I2C), MCU_SPI (harness MCU_SPI), SPI_Master/!Slave (in), USB_DATA (harness USB_DATA)

### Harnesses
USB_DATA: D-, D+
FPGA_SPI: MISO, MOSI, SCK, SS
MCU_SPI: MISO, MOSI, SCK, SS
uSD_SPI: nCS, MOSI, MISO, SCK
I2C: SDA, SCL

### Nets
3V3: C14.1 P2.1 R1.2 R31.2 R41.1 R42.1 U1.2(SREF) U2.2(SREF) U11.16(VCC)
5V0_RPi: P5.2 P5.4
5V0_USB: J6.1(VBUS)
GND: C1.2 C2.2 C14.2 J6.5(GND) J6.MH1(Shell) J6.MH2(Shell) J6.MH3(Shell) J6.MH4(Shell) P2.24 P5.6 P5.9 P5.14 P5.20 P5.25 P5.30 P5.34 P5.39 P6.2 U1.1(GND) U2.1(GND) U11.8(GND) U11.15(~{BE})
VCC_HDR: P6.1
FPGA_MISO: U11.2(1B1) ; port FPGA_SPI.MISO
FPGA_MOSI: U11.14(4B1) ; port FPGA_SPI.MOSI
FPGA_SCK: U11.11(3B1) ; port FPGA_SPI.SCK
FPGA_SS: U11.5(2B1) ; port FPGA_SPI.SS
FPGAIO_A2: R2.1
FPGAIO_A3: R5.1
FPGAIO_A4: R37.1
FPGAIO_A5: R38.1
FPGAIO_A6: R39.1
FPGAIO_A7: R14.1
FPGAIO_A8: R15.1
FPGAIO_A9: R16.1
FPGAIO_A10: R17.1
FPGAIO_A11: R18.1
FPGAIO_A12: R19.1
FPGAIO_A13: R20.1
FPGAIO_A14: R21.1
FPGAIO_A15: R22.1
FPGAIO_A16: R23.1
FPGAIO_A17: R24.1
FPGAIO_A18: R25.1
FPGAIO_A19: R26.1
FPGAIO_A20: R27.1
FPGAIO_A21: R28.1
FPGAIO_A22: R29.1
FPGAIO_A23: R30.1
FPGAIO_A24: R35.1
FPGAIO_A25: R36.1
FPGAIO_B0: U2.24(S22)
FPGAIO_B1: U2.23(S21)
FPGAIO_B2: U2.22(S20)
FPGAIO_B3: U2.21(S19)
FPGAIO_B4: U2.20(S18)
FPGAIO_B5: U2.19(S17)
FPGAIO_B6: U2.18(S16)
FPGAIO_B7: U2.17(S15)
FPGAIO_B8: U2.16(S14)
FPGAIO_B9: U2.15(S13)
FPGAIO_B10: U2.14(S12)
FPGAIO_B11: U2.13(S11)
FPGAIO_B12: U2.12(S10)
FPGAIO_B13: U2.11(S9)
FPGAIO_B14: U2.10(S8)
FPGAIO_B15: U2.9(S7)
FPGAIO_B16: U2.8(S6)
FPGAIO_B17: U2.7(S5)
FPGAIO_B18: U2.6(S4)
FPGAIO_B19: U2.5(S3)
FPGAIO_B20: U2.4(S2)
FPGAIO_B21: U2.3(S1)
GPIO_A2: P5.3 U1.46(D1)
GPIO_A3: P5.5 U1.45(D2)
GPIO_A4_INTA: P1.1 P5.7 U1.44(D3)
GPIO_A5_INTB: P1.2 P5.29 U1.43(D4)
GPIO_A6_INTC: P1.3 P5.31 U1.42(D5)
GPIO_A7_INTD: P1.4 P5.26 U1.41(D6)
GPIO_A8_ACKA: P3.1 P5.24 U1.40(D7)
GPIO_A9_ACKB: P3.2 P5.21 U1.39(D8)
GPIO_A10_ACKC: P3.3 P5.19 U1.38(D9)
GPIO_A11_ACKD: P3.4 P5.23 U1.37(D10)
GPIO_A12: P5.32 U1.36(D11)
GPIO_A13: P5.33 U1.35(D12)
GPIO_A14: P5.8 U1.34(D13)
GPIO_A15: P5.10 U1.33(D14)
GPIO_A16_DATA0: P4.1 P5.36 U1.32(D15)
GPIO_A17_DATA1: P4.2 P5.11 U1.31(D16)
GPIO_A18_DATA2: P4.3 P5.12 U1.30(D17)
GPIO_A19_DATA3: P4.4 P5.35 U1.29(D18)
GPIO_A20_DATA4: P4.5 P5.38 U1.28(D19)
GPIO_A21_DATA5: P4.6 P5.40 U1.27(D20)
GPIO_A22_DATA6: P4.7 P5.15 U1.26(D21)
GPIO_A23_R/!W: P4.8 P5.16 U1.25(D22)
GPIO_A24: P5.18 R35.2
GPIO_A25: P5.22 R36.2
GPIO_A26: P5.37
GPIO_A27: P5.13
GPIO_B0: P2.2 U2.25(D22)
GPIO_B1: P2.3 U2.26(D21)
GPIO_B2: P2.4 U2.27(D20)
GPIO_B3: P2.5 U2.28(D19)
GPIO_B4: P2.6 U2.29(D18)
GPIO_B5: P2.7 U2.30(D17)
GPIO_B6: P2.8 U2.31(D16)
GPIO_B7: P2.9 U2.32(D15)
GPIO_B8: P2.10 U2.33(D14)
GPIO_B9: P2.11 U2.34(D13)
GPIO_B10: P2.12 U2.35(D12)
GPIO_B11: P2.13 U2.36(D11)
GPIO_B12: P2.14 U2.37(D10)
GPIO_B13: P2.15 U2.38(D9)
GPIO_B14: P2.16 U2.39(D8)
GPIO_B15: P2.17 U2.40(D7)
GPIO_B16: P2.18 U2.41(D6)
GPIO_B17: P2.19 U2.42(D5)
GPIO_B18: P2.20 U2.43(D4)
GPIO_B19: P2.21 U2.44(D3)
GPIO_B20: P2.22 U2.45(D2)
GPIO_B21: P2.23 U2.46(D1)
MISO: U11.3(1B2) ; port MCU_SPI.MISO
MOSI: U11.13(4B2) ; port MCU_SPI.MOSI
SCK: U11.10(3B2) ; port MCU_SPI.SCK
SCL: P5.28 P7.2 R42.2 ; port I2C.SCL  [project net FPGA_SCL]
SDA: P5.27 P7.1 R41.2 ; port I2C.SDA  [project net FPGA_SDA]
SPI_M/!S: U11.1(S) ; port SPI_Master/!Slave
SS: U11.6(2B2) ; port MCU_SPI.SS
uSD_MISO: U11.4(1A) ; sheet U_MicroSD/uSD_SPI.MISO
uSD_MOSI: U11.12(4A) ; sheet U_MicroSD/uSD_SPI.MOSI
uSD_SCK: U11.9(3A) ; sheet U_MicroSD/uSD_SPI.SCK
uSD_SS: U11.7(2A) ; sheet U_MicroSD/uSD_SPI.nCS
NetC1_1: C1.1 R1.1 U1.47(DREF) U1.48(GREF)
NetC2_1: C2.1 R31.1 U2.47(DREF) U2.48(GREF)
NetJ6_2: J6.2(D-) ; port USB_DATA.D-
NetJ6_3: J6.3(D+) ; port USB_DATA.D+
NetR2_2: R2.2 U1.3(S1)
NetR5_2: R5.2 U1.4(S2)
NetR14_2: R14.2 U1.8(S6)
NetR15_2: R15.2 U1.9(S7)
NetR16_2: R16.2 U1.10(S8)
NetR17_2: R17.2 U1.11(S9)
NetR18_2: R18.2 U1.12(S10)
NetR19_2: R19.2 U1.13(S11)
NetR20_2: R20.2 U1.14(S12)
NetR21_2: R21.2 U1.15(S13)
NetR22_2: R22.2 U1.16(S14)
NetR23_2: R23.2 U1.17(S15)
NetR24_2: R24.2 U1.18(S16)
NetR25_2: R25.2 U1.19(S17)
NetR26_2: R26.2 U1.20(S18)
NetR27_2: R27.2 U1.21(S19)
NetR28_2: R28.2 U1.22(S20)
NetR29_2: R29.2 U1.23(S21)
NetR30_2: R30.2 U1.24(S22)
NetR37_2: R37.2 U1.5(S3)
NetR38_2: R38.2 U1.6(S4)
NetR39_2: R39.2 U1.7(S5)

Not connected (* = marked no-connect by the designer): J6 4(ID); P5 1 17

### Buses and harness runs
bus FPGAIO_A[2..25]
bus FPGAIO_A[2..27] = port FPGAIO_A[2..27]
bus FPGAIO_B[0..21]
harness port AS_INTERFACE = sheet U_Config_Interfaces/AS_INTERFACE
harness port HARD_JTAG = sheet U_Config_Interfaces/HARD_JTAG

### Notes on the sheet
- I2C
- (near P1) INT
- (near P3) ACK
- (near P4) Data/Ctrl
- (near R36) 24x270ohm
- (near P7) I2C
- (near P6) Ext_Power
- (near P5) RPi Header
- Title
- Size:
- Date:
- A4
- Number:
- Time:
- Revision:
- Sheet
- of
- File:

### Library data of the parts
C1 C2 C14 = D-101-0027: as C10 on sheet PSU_3V3_LD29300; Capacitance: 100nF; Dielectric: X7R; Mounting Technology: Surface Mount; Rated Voltage: 10 V; Status: Production; Technology: Ceramic; Tolerance: 10 %; Category: Capacitor
J6 = USB_Mini-B: Connector SMD USB Type Mini-B; Manufacturer 1: Molex Connector Corporation; SCDType: undef; Package / Case: SMD; Supplier 1: Digi-Key; Supplier Part Number 1: WM5461CT-ND
P1 P3 = Header 4: Header, 4-Pin; LatestRevisionDate: 17-Jul-2002; LatestRevisionNote: Re-released for DXP Platform.; Publisher: Altium Limited
P2 = Header 24: Header, 24-Pin; LatestRevisionDate: 17-Jul-2002; LatestRevisionNote: Re-released for DXP Platform.; Publisher: Altium Limited
P4 = Header 8: Header, 8-Pin; LatestRevisionDate: 17-Jul-2002; LatestRevisionNote: Re-released for DXP Platform.; Publisher: Altium Limited
P5 = Header 20X2: Header, 20-Pin, Dual row; LatestRevisionDate: 17-Jul-2002; LatestRevisionNote: Re-released for DXP Platform.; Publisher: Altium Limited
P6 P7 = Header 2: Header, 2-Pin; LatestRevisionDate: 17-Jul-2002; LatestRevisionNote: Re-released for DXP Platform.; Publisher: Altium Limited
R1 R2 R5 R14-R31 R35-R39 R41 R42 = D-100-0116: Tolerance: 1 %; Mounting Technology: Surface Mount; Status: Production; Category: Resistor
  R1 R31: Value: 200k
  R2 R5 R14-R30 R35-R39: Value: 270
  R41 R42: Value: 2.2k
U1 U2 = GTL2000: 22-bit bi-directional low voltage translator
U11 = ADG3257BRQ: 933 Mbps, High Speed, 3.3 V / 5 V Quad 2:1 Mux / Demux (4-Bit, 1 of 2) Bus Switch, 100 ps Prop Delay, -40 to 85 degC, 16-pin SOP (RQ-16), Tube; Manufacturer: Analog Devices; ICC1: 1uA; DatasheetVersion: Rev. E; PackageVersion: Aug-05; PackageReference: RQ-16; PackageDescription: 16-Pin Shrink Small Outline Package, Body 4.9 x 3.9 mm, Pitch 0.64 mm; Supplier 1: Digi-Key; Supplier Part Number 1: ADG3257BRQ-ND; Supplier 2: Mouser; Supplier Part Number 2: 584-ADG3257BRQ; Data Rate (typ): 933Mbps; Packing: Tube; Mounting Technology: Surface Mount; Code_JEDEC: MO-137-AB; PartNumber: ADG3257BRQ; ComponentLink1Description: Manufacturer URL; ComponentLink1URL: http://www.analog.com/en/index.html; ComponentLink2Description: Datasheet; ComponentLink2URL: http://www.analog.com/static/imported-files/data_sheets/ADG3257.pdf; ComponentLink3Description: Package Specification; ComponentLink3URL: http://www.analog.com/static/imported-files/packages/5595549651201762937RQ_16.pdf

## Sheet Config_Interfaces.SchDoc: CONFIG. INTERFACES
size A4; DocumentNumber: 3; SheetNumber: 3; SheetTotal: 18
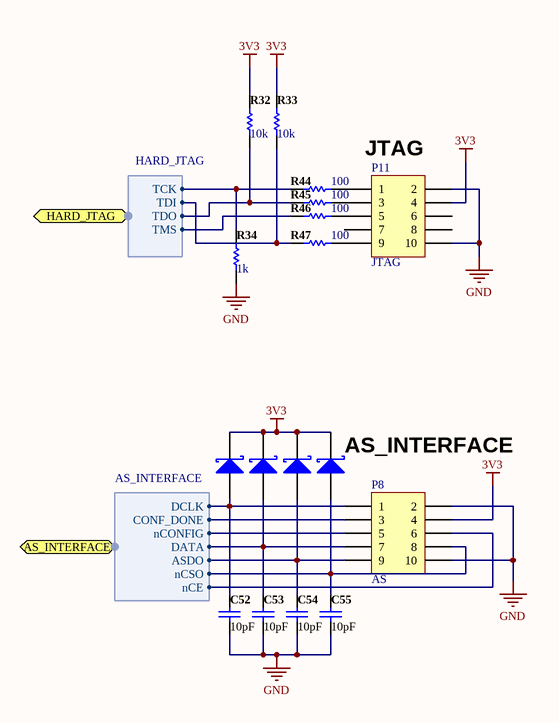
[diagram p9: Config_Interfaces.SchDoc]

### Parts
C52  10pF  [0805C-GENERIC]
C53  10pF  [0805C-GENERIC]
C54  10pF  [0805C-GENERIC]
C55  10pF  [0805C-GENERIC]
D10  D Schottky  [LED-0805-K]  (value not drawn)
D11  D Schottky  [LED-0805-K]  (value not drawn)
D12  D Schottky  [LED-0805-K]  (value not drawn)
D13  D Schottky  [LED-0805-K]  (value not drawn)
P8  Header 5X2  [10P_PCB_HEADER_BRD_MNT]  (value not drawn)
P11  Header 5X2  [10P_PCB_HEADER_BRD_MNT]  (value not drawn)
R32  10k  [0805R-10K]
R33  10k  [0805R-10K]
R34  1k  [0805R-1K]
R44  100  [0805R-100]
R45  100  [0805R-100]
R46  100  [0805R-100]
R47  100  [0805R-100]

### Ports
AS_INTERFACE (harness AS_INTERFACE), HARD_JTAG (harness HARD_JTAG)

### Harnesses
HARD_JTAG: TCK, TDI, TDO, TMS
AS_INTERFACE: DCLK, CONF_DONE, nCONFIG, ASDO, nCE, nCSO, DATA

### Nets
3V3: D10.K D11.K D12.K D13.K P8.4 P11.4 R32.1 R33.1
GND: C52.2 C53.2 C54.2 C55.2 P8.2 P8.10 P11.2 P11.10 R34.2
NetC52_1: C52.1 D10.A P8.1 ; port AS_INTERFACE.DCLK
NetC53_1: C53.1 D11.A P8.7 ; port AS_INTERFACE.DATA
NetC54_1: C54.1 D12.A P8.9 ; port AS_INTERFACE.ASDO
NetC55_1: C55.1 D13.A P8.8 ; port AS_INTERFACE.nCSO
NetP8_3: P8.3 ; port AS_INTERFACE.CONF_DONE
NetP8_5: P8.5 ; port AS_INTERFACE.nCONFIG
NetP8_6: P8.6 ; port AS_INTERFACE.nCE
NetP11_1: P11.1 R44.2
NetP11_3: P11.3 R45.2
NetP11_5: P11.5 R46.2
NetP11_9: P11.9 R47.2
NetR32_2: R32.2 R45.1 ; port HARD_JTAG.TDO
NetR33_2: R33.2 R47.1 ; port HARD_JTAG.TDI
NetR34_1: R34.1 R44.1 ; port HARD_JTAG.TCK
NetR46_1: R46.1 ; port HARD_JTAG.TMS

Not connected (* = marked no-connect by the designer): P11 6 7 8

### Notes on the sheet
- JTAG
- (near P11) JTAG
- (near D13) AS_INTERFACE
- (near P8) AS
- Title
- Size:
- Date:
- A4
- Number:
- Time:
- Revision:
- Sheet
- of
- File:

### Library data of the parts
C52-C55 = D-101-0027: as C10 on sheet PSU_3V3_LD29300; Capacitance: 10pF; Dielectric: X7R; Mounting Technology: Surface Mount; Rated Voltage: 10 V; Status: Production; Technology: Ceramic; Tolerance: 10 %; Category: Capacitor
D10-D13 = D Schottky: Schottky Diode - SD0805S020S1R0; Published: 8-Jun-2000; LatestRevisionDate: 17-Jul-2002; LatestRevisionNote: Re-released for DXP Platform.; PackageReference: SMB; Publisher: Altium Limited; PackageDescription: 0805; Code_JEDEC: 0805
P8 P11 = Header 5X2: Header, 5-Pin, Dual row; LatestRevisionDate: 17-Jul-2002; LatestRevisionNote: Re-released for DXP Platform.; Publisher: Altium Limited
R32-R34 R44-R47 = D-100-0116: Tolerance: 1 %; Mounting Technology: Surface Mount; Status: Production; Category: Resistor
  R32 R33: Value: 10k
  R34: Value: 1k
  R44-R47: Value: 100

## Sheet MicroSD.SchDoc: MICRO-SD
size A4; DocumentNumber: 4; SheetNumber: 4; SheetTotal: 18
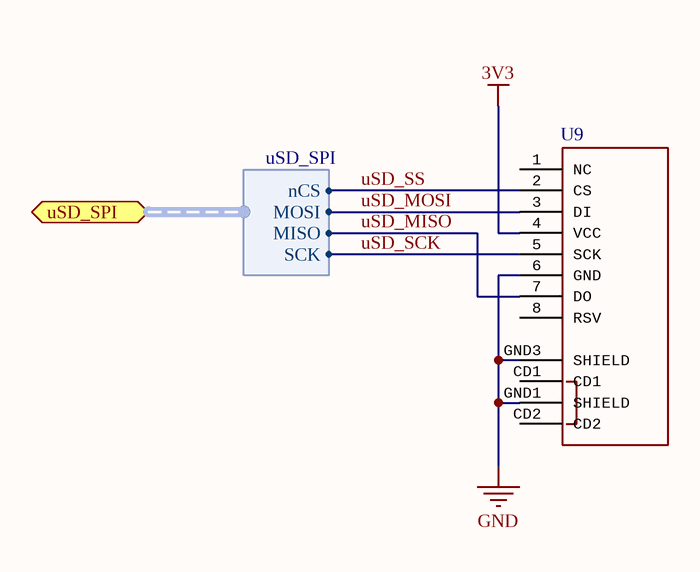
[diagram p10: MicroSD.SchDoc]

### Parts
U9  microSD Socket  [MICRO-SD-SOCKET-PP]  (value not drawn)

### Ports
uSD_SPI (harness uSD_SPI)

### Harnesses
uSD_SPI: nCS, MOSI, MISO, SCK

### Nets
3V3: U9.4(VCC)
GND: U9.6(GND) U9.GND1(SHIELD) U9.GND3(SHIELD)
uSD_MISO: U9.7(DO) ; port uSD_SPI.MISO
uSD_MOSI: U9.3(DI) ; port uSD_SPI.MOSI
uSD_SCK: U9.5(SCK) ; port uSD_SPI.SCK
uSD_SS: U9.2(CS) ; port uSD_SPI.nCS

Not connected (* = marked no-connect by the designer): U9 1(NC) 8(RSV) CD1 CD2

### Notes on the sheet
- Title
- Size:
- Date:
- A4
- Number:
- Time:
- Revision:
- Sheet
- of
- File:

### Library data of the parts
U9 = USD-SOCKETNEW: microSD Socket, Push-push type. Schematic element and footprint production proven. Spark Fun Electronics SKU : PRT-00127. tDoc lines correctly indicate media card edge positions when inserting (unlocked, locked, depressed). NOTE: CD1 and CD2 are connected internally; PROD_ID: CONN-07820

## Sheet FPGA.SchDoc: FPGA TOP
size A4; DocumentNumber: 6; SheetNumber: 6; SheetTotal: 18
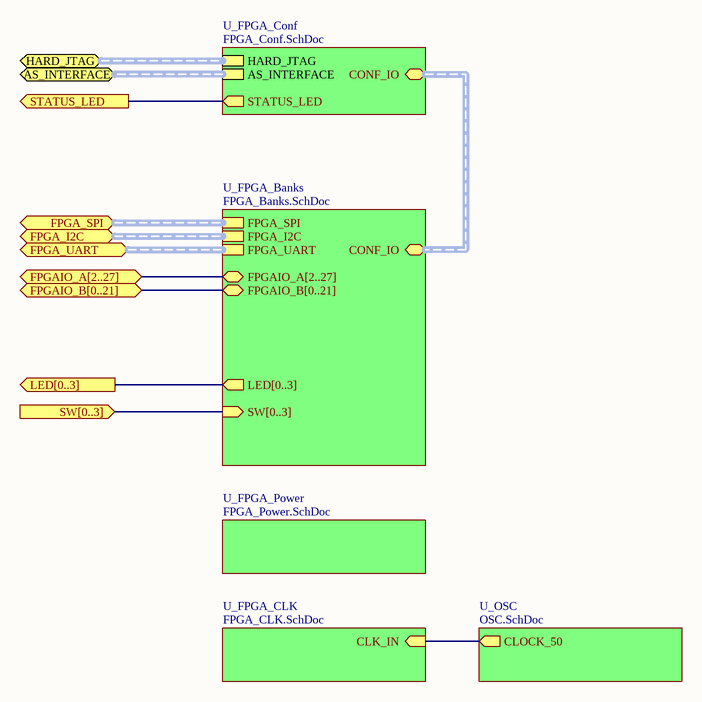
[diagram p11: FPGA.SchDoc]

### Sub-sheets
U_FPGA_Banks = FPGA_Banks.SchDoc: FPGA_SPI (harness FPGA_SPI), FPGA_I2C (harness I2C), FPGAIO_A[2..27] (bidir), FPGAIO_B[0..21] (bidir, harness TEST_INT), FPGA_UART (harness FPGA_UART), CONF_IO (harness CONF_IO), SW[0..3] (in), LED[0..3] (out)
U_FPGA_CLK = FPGA_CLK.SchDoc: CLK_IN (in)
U_FPGA_Conf = FPGA_Conf.SchDoc: HARD_JTAG (harness HARD_JTAG), AS_INTERFACE (harness AS_INTERFACE), STATUS_LED (out), CONF_IO (harness CONF_IO)
U_FPGA_Power = FPGA_Power.SchDoc: no entries
U_OSC = OSC.SchDoc: CLOCK_50 (out)

### Ports
AS_INTERFACE (harness AS_INTERFACE), FPGA_I2C (harness I2C), FPGA_SPI (harness FPGA_SPI), FPGA_UART (harness FPGA_UART), FPGAIO_A[2..27] (bidir), FPGAIO_B[0..21] (bidir, harness TEST_INT), HARD_JTAG (harness HARD_JTAG), LED[0..3] (out), STATUS_LED (out), SW[0..3] (in)

### Nets
FPGA_CLK: sheet U_FPGA_CLK/CLK_IN, sheet U_OSC/CLOCK_50
NetP8_3: port STATUS_LED, sheet U_FPGA_Conf/STATUS_LED

### Buses and harness runs
bus port FPGAIO_A[2..27] = sheet U_FPGA_Banks/FPGAIO_A[2..27]
bus port LED[0..3] = sheet U_FPGA_Banks/LED[0..3]
bus port SW[0..3] = sheet U_FPGA_Banks/SW[0..3]
harness port AS_INTERFACE = sheet U_FPGA_Conf/AS_INTERFACE
harness port FPGA_I2C = sheet U_FPGA_Banks/FPGA_I2C
harness port FPGA_SPI = sheet U_FPGA_Banks/FPGA_SPI
harness port FPGA_UART = sheet U_FPGA_Banks/FPGA_UART
harness port HARD_JTAG = sheet U_FPGA_Conf/HARD_JTAG
harness sheet U_FPGA_Banks/CONF_IO = sheet U_FPGA_Conf/CONF_IO

### Notes on the sheet
- Title
- Size:
- Date:
- A4
- Number:
- Time:
- Revision:
- Sheet
- of
- File:

## Sheet FPGA_Conf.SchDoc: FPGA CONFIGURATION
size A4; DocumentNumber: 9; SheetNumber: 9; SheetTotal: 18
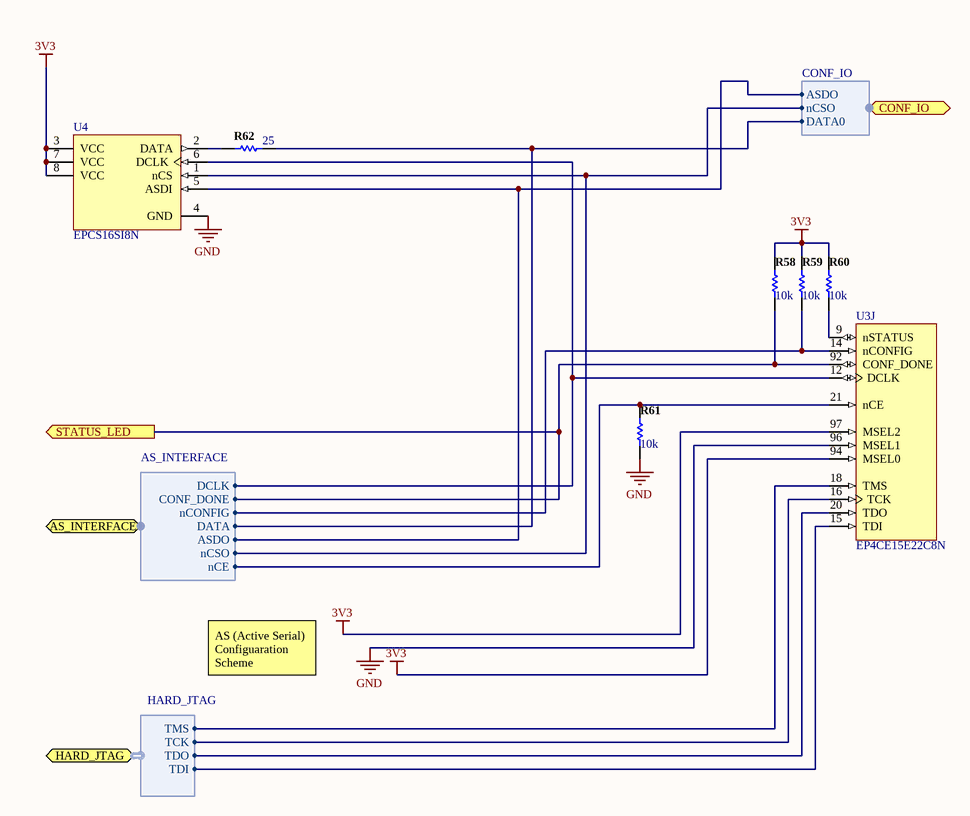
[diagram p12: FPGA_Conf.SchDoc]

### Parts
R58  10k  [0805R-10K]
R59  10k  [0805R-10K]
R60  10k  [0805R-10K]
R61  10k  [0805R-10K]
R62  25  [0805R-0R1]
U3  EP4CE15E22C8N  [EQFP144_A-165_D2-67_N]  (part J of 13)
U4  EPCS16SI8N  [SOIC8_N]

### Ports
AS_INTERFACE (harness AS_INTERFACE), CONF_IO (harness CONF_IO), HARD_JTAG (harness HARD_JTAG), STATUS_LED (out)

### Harnesses
HARD_JTAG: TCK, TDI, TDO, TMS
AS_INTERFACE: DCLK, CONF_DONE, nCONFIG, ASDO, nCE, nCSO, DATA
CONF_IO: ASDO, nCSO, DATA0

### Nets
3V3: R58.1 R59.1 R60.1 U3.94(MSEL0) U3.97(MSEL2) U4.3(VCC) U4.7(VCC) U4.8(VCC)
GND: R61.2 U3.96(MSEL1) U4.4(GND)
NetC52_1: U3.12(DCLK) U4.6(DCLK) ; port AS_INTERFACE.DCLK
NetC53_1: R62.2 ; port AS_INTERFACE.DATA, port CONF_IO.DATA0
NetC54_1: U4.5(ASDI) ; port AS_INTERFACE.ASDO, port CONF_IO.ASDO
NetC55_1: U4.1(nCS) ; port AS_INTERFACE.nCSO, port CONF_IO.nCSO
NetP8_3: R58.2 U3.92(CONF_DONE) ; port STATUS_LED, port AS_INTERFACE.CONF_DONE
NetP8_5: R59.2 U3.14(nCONFIG) ; port AS_INTERFACE.nCONFIG
NetP8_6: R61.1 U3.21(nCE) ; port AS_INTERFACE.nCE
NetR32_2: U3.20(TDO) ; port HARD_JTAG.TDO
NetR33_2: U3.15(TDI) ; port HARD_JTAG.TDI
NetR34_1: U3.16(TCK) ; port HARD_JTAG.TCK
NetR46_1: U3.18(TMS) ; port HARD_JTAG.TMS
NetR60_2: R60.2 U3.9(nSTATUS)
NetR62_1: R62.1 U4.2(DATA)

### Notes on the sheet
- AS (Active Serial) Configuaration Scheme
- Title
- Size:
- Date:
- A4
- Number:
- Time:
- Revision:
- Sheet
- of
- File:

### Library data of the parts
R58-R62 = D-100-0116: Tolerance: 1 %; Mounting Technology: Surface Mount; Status: Production; Category: Resistor
  R58-R61: Value: 10k
  R62: Value: 25
U3 = EP4CE15E22C8N: Cyclone IV Family FPGA, 1.2V Core, 81 I/O Pins, 4 PLLs, 144-Pin QFP, Speed Grade 8, Commercial Grade, Pb-Free; Manufacturer: Altera; DatasheetVersion: ver1.6, Nov-2011; PackageVersion: ver1.0, Jun-2011; PackageReference: EQFP144_A-165_D2-67; PackageDescription: 144-Pin Plastic Enhanced Quad Flat Pack (EQFP) - Wire Bond - A:1.65 - D2:6.7; Code_JEDEC: MS-026-BFB-HD; ComponentLink1Description: Manufacturer URL; ComponentLink1URL: http://www.altera.com/; ComponentLink2Description: Handbook; ComponentLink2URL: http://www.altera.com/literature/hb/cyclone-iv/cyclone4-handbook.pdf; ComponentLink3Description: Pinout; ComponentLink3URL: http://www.altera.com/literature/lit-dp.jsp?category=cyc%204&showspreadsheet=y; ComponentLink4Description: Package Specification; ComponentLink4URL: http://www.altera.com/devicepackaging/04R00221-02.pdf
U4 = EPCS16SI8N: EPCS16 Series, In-system programmable 3.3V serial configuration device, 8-Pin SOIC, 16-Megabit, Industrial Grade, Pb-Free; Configures: All Arria series, all Cyclone series and all Stratix series (except Stratix); DatasheetVersion: ver3.0, Dec-2009; PackageVersion: ver14.2, Oct-2005; PackageReference: SOIC8; PackageDescription: 8-Pin Small Outline Integrated Circuit Package (SOIC8); Code_JEDEC: MS-012-AA; Code_IPC: SOIC127P600-8; ComponentLink1Description: Manufacturer URL; ComponentLink1URL: http://www.altera.com/; ComponentLink2Description: Configuration Handbook; ComponentLink2URL: http://www.altera.com/literature/hb/cfg/config_handbook.pdf; ComponentLink3Description: Pinout; ComponentLink3URL: http://www.altera.com/literature/hb/cfg/config_handbook.pdf; ComponentLink4Description: Package Specification; ComponentLink4URL: http://www.altera.com/support/devices/packaging/specifications/pkg-pin/pdf/016-SOIC.pdf

## Sheet FPGA_CLK.SchDoc: FPGA CLOCK
size A4; DocumentNumber: 8; SheetNumber: 8; SheetTotal: 18
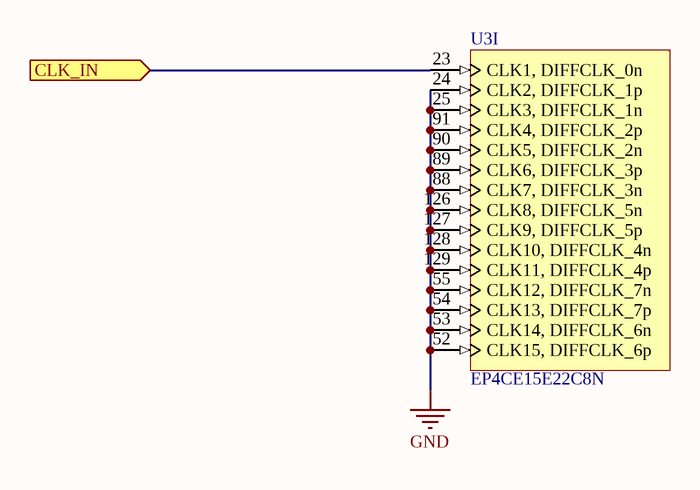
[diagram p13: FPGA_CLK.SchDoc]

### Parts
U3  EP4CE15E22C8N  [EQFP144_A-165_D2-67_N]  (part I of 13)

### Ports
CLK_IN (in)

### Nets
GND: U3.24(CLK2,_DIFFCLK_1p) U3.25(CLK3,_DIFFCLK_1n) U3.52(CLK15,_DIFFCLK_6p) U3.53(CLK14,_DIFFCLK_6n) U3.54(CLK13,_DIFFCLK_7p) U3.55(CLK12,_DIFFCLK_7n) U3.88(CLK7,_DIFFCLK_3n) U3.89(CLK6,_DIFFCLK_3p) U3.90(CLK5,_DIFFCLK_2n) U3.91(CLK4,_DIFFCLK_2p) U3.126(CLK8,_DIFFCLK_5n) U3.127(CLK9,_DIFFCLK_5p) U3.128(CLK10,_DIFFCLK_4n) U3.129(CLK11,_DIFFCLK_4p)
FPGA_CLK: U3.23(CLK1,_DIFFCLK_0n) ; port CLK_IN

### Notes on the sheet
- Title
- Size:
- Date:
- A4
- Number:
- Time:
- Revision:
- Sheet
- of
- File:

### Library data of the parts
U3 = EP4CE15E22C8N: as U3 on sheet FPGA_Conf; DatasheetVersion: ver1.6, Nov-2011; PackageVersion: ver1.0, Jun-2011; PackageReference: EQFP144_A-165_D2-67; PackageDescription: 144-Pin Plastic Enhanced Quad Flat Pack (EQFP) - Wire Bond - A:1.65 - D2:6.7; Code_JEDEC: MS-026-BFB-HD; ComponentLink1Description: Manufacturer URL; ComponentLink1URL: http://www.altera.com/; ComponentLink2Description: Handbook; ComponentLink2URL: http://www.altera.com/literature/hb/cyclone-iv/cyclone4-handbook.pdf; ComponentLink3Description: Pinout; ComponentLink3URL: http://www.altera.com/literature/lit-dp.jsp?category=cyc%204&showspreadsheet=y; ComponentLink4Description: Package Specification; ComponentLink4URL: http://www.altera.com/devicepackaging/04R00221-02.pdf

## Sheet FPGA_Power.SchDoc: FPGA POWER
size A4; DocumentNumber: 10; SheetNumber: 10; SheetTotal: 18
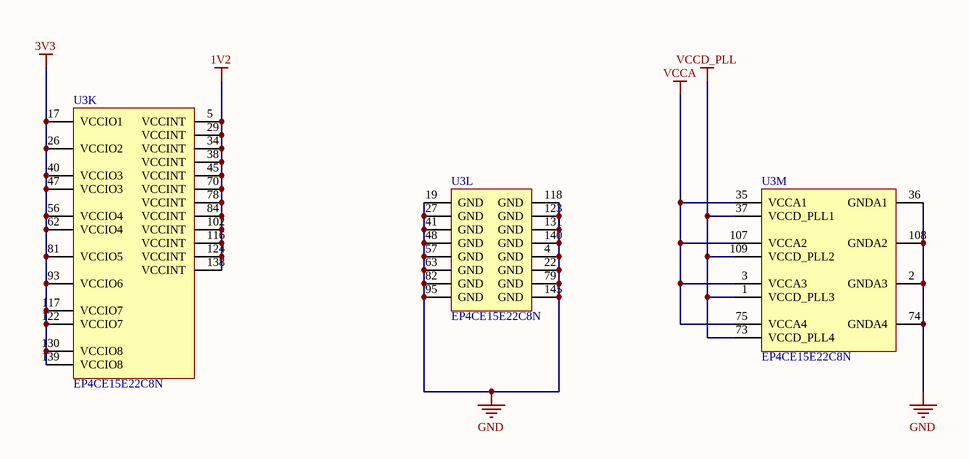
[diagram p14: FPGA_Power.SchDoc]

### Parts
U3  EP4CE15E22C8N  [EQFP144_A-165_D2-67_N]  (parts K,L,M of 13)

### Nets
1V2: U3.5(VCCINT) U3.29(VCCINT) U3.34(VCCINT) U3.38(VCCINT) U3.45(VCCINT) U3.70(VCCINT) U3.78(VCCINT) U3.84(VCCINT) U3.102(VCCINT) U3.116(VCCINT) U3.124(VCCINT) U3.138(VCCINT)
3V3: U3.17(VCCIO1) U3.26(VCCIO2) U3.40(VCCIO3) U3.47(VCCIO3) U3.56(VCCIO4) U3.62(VCCIO4) U3.81(VCCIO5) U3.93(VCCIO6) U3.117(VCCIO7) U3.122(VCCIO7) U3.130(VCCIO8) U3.139(VCCIO8)
GND: U3.2(GNDA3) U3.4(GND) U3.19(GND) U3.22(GND) U3.27(GND) U3.36(GNDA1) U3.41(GND) U3.48(GND) U3.57(GND) U3.63(GND) U3.74(GNDA4) U3.79(GND) U3.82(GND) U3.95(GND) U3.108(GNDA2) U3.118(GND) U3.123(GND) U3.131(GND) U3.140(GND) U3.145(GND)
VCCA: U3.3(VCCA3) U3.35(VCCA1) U3.75(VCCA4) U3.107(VCCA2)
VCCD_PLL: U3.1(VCCD_PLL3) U3.37(VCCD_PLL1) U3.73(VCCD_PLL4) U3.109(VCCD_PLL2)

### Notes on the sheet
- Title
- Size:
- Date:
- A4
- Number:
- Time:
- Revision:
- Sheet
- of
- File:

### Library data of the parts
U3 = EP4CE15E22C8N: as U3 on sheet FPGA_Conf; DatasheetVersion: ver1.6, Nov-2011; PackageVersion: ver1.0, Jun-2011; PackageReference: EQFP144_A-165_D2-67; PackageDescription: 144-Pin Plastic Enhanced Quad Flat Pack (EQFP) - Wire Bond - A:1.65 - D2:6.7; Code_JEDEC: MS-026-BFB-HD; ComponentLink1Description: Manufacturer URL; ComponentLink1URL: http://www.altera.com/; ComponentLink2Description: Handbook; ComponentLink2URL: http://www.altera.com/literature/hb/cyclone-iv/cyclone4-handbook.pdf; ComponentLink3Description: Pinout; ComponentLink3URL: http://www.altera.com/literature/lit-dp.jsp?category=cyc%204&showspreadsheet=y; ComponentLink4Description: Package Specification; ComponentLink4URL: http://www.altera.com/devicepackaging/04R00221-02.pdf

## Sheet FPGA_Banks.SchDoc: FPGA Banks
size A4; DocumentNumber: 7; SheetNumber: 7; SheetTotal: 18
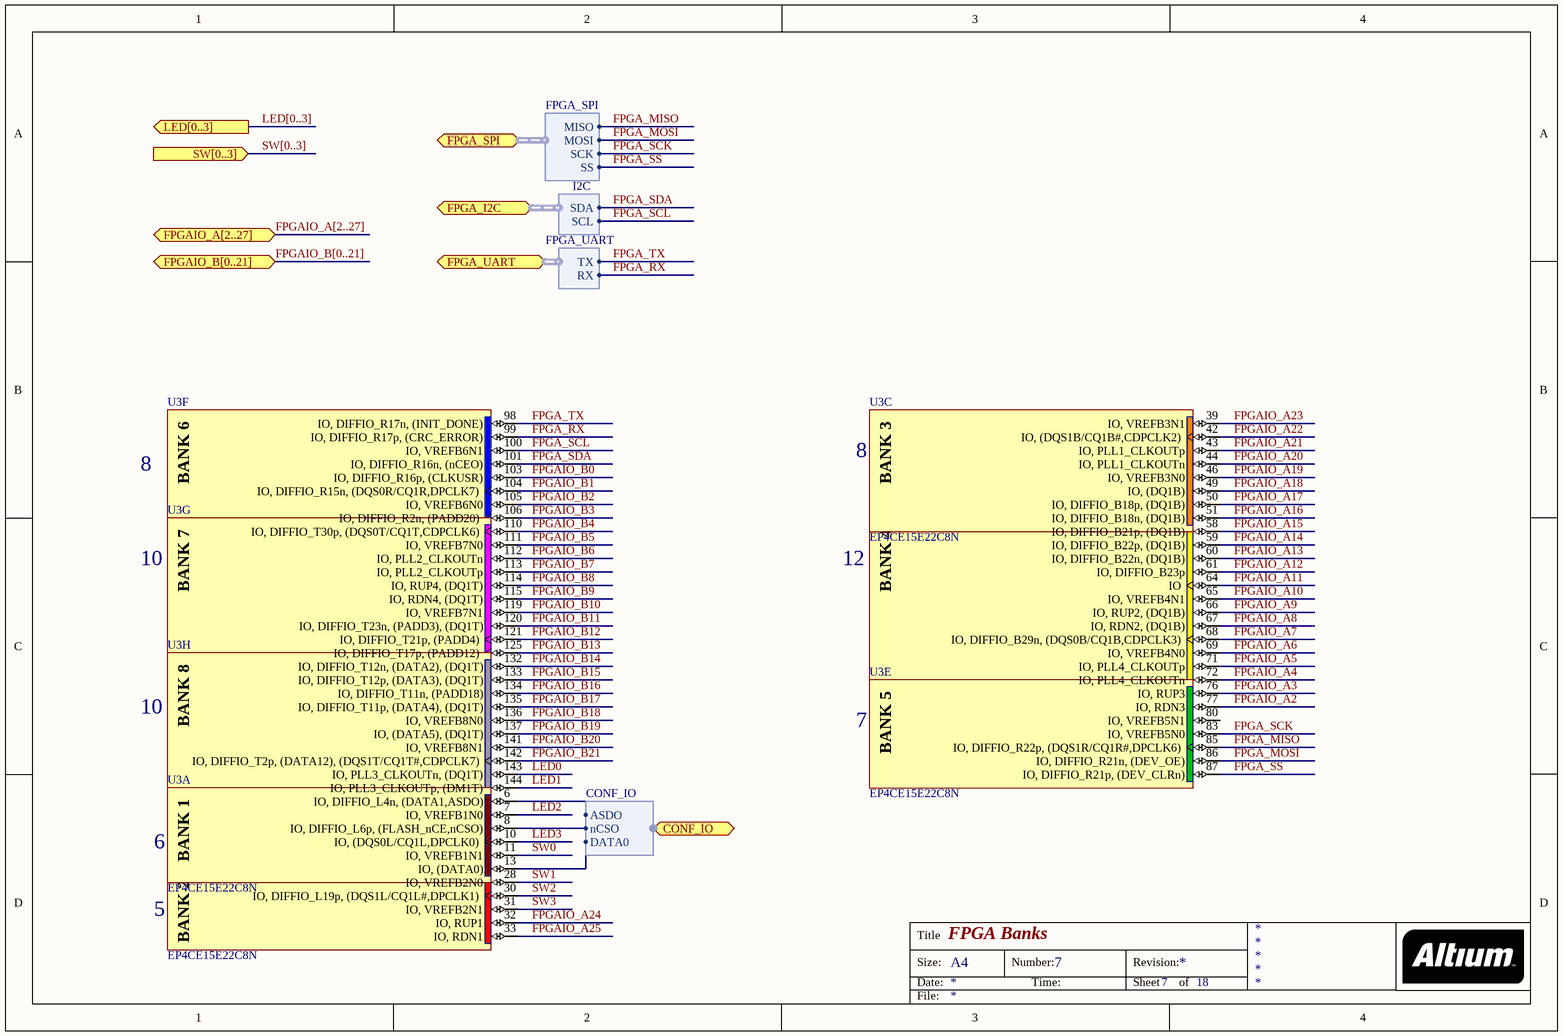
[diagram p15: FPGA_Banks.SchDoc]

### Parts
U3  EP4CE15E22C8N  [EQFP144_A-165_D2-67_N]  (parts A,B,C,D,E,F,G,H of 13)

### Ports
CONF_IO (harness CONF_IO), FPGA_I2C (harness I2C), FPGA_SPI (harness FPGA_SPI), FPGA_UART (harness FPGA_UART), FPGAIO_A[2..27] (bidir), FPGAIO_B[0..21] (bidir, harness TEST_INT), LED[0..3] (out), SW[0..3] (in)

### Harnesses
FPGA_SPI: MISO, MOSI, SCK, SS
I2C: SDA, SCL
FPGA_UART: TX, RX
CONF_IO: ASDO, nCSO, DATA0

### Nets
FPGA_MISO: U3.85(IO,_DIFFIO_R22p,_(DQS1R/CQ1R#,DPCLK6)) ; port FPGA_SPI.MISO
FPGA_MOSI: U3.86(IO,_DIFFIO_R21n,_(DEV_OE)) ; port FPGA_SPI.MOSI
FPGA_RX: U3.99(IO,_DIFFIO_R17p,_(CRC_ERROR)) ; port FPGA_UART.RX
FPGA_SCK: U3.83(IO,_VREFB5N0) ; port FPGA_SPI.SCK
FPGA_SCL: U3.100(IO,_VREFB6N1) ; port FPGA_I2C.SCL
FPGA_SDA: U3.101(IO,_DIFFIO_R16n,_(nCEO)) ; port FPGA_I2C.SDA
FPGA_SS: U3.87(IO,_DIFFIO_R21p,_(DEV_CLRn)) ; port FPGA_SPI.SS
FPGA_TX: U3.98(IO,_DIFFIO_R17n,_(INIT_DONE)) ; port FPGA_UART.TX
FPGAIO_A2: U3.77(IO,_RDN3)
FPGAIO_A3: U3.76(IO,_RUP3)
FPGAIO_A4: U3.72(IO,_PLL4_CLKOUTn)
FPGAIO_A5: U3.71(IO,_PLL4_CLKOUTp)
FPGAIO_A6: U3.69(IO,_VREFB4N0)
FPGAIO_A7: U3.68(IO,_DIFFIO_B29n,_(DQS0B/CQ1B,CDPCLK3))
FPGAIO_A8: U3.67(IO,_RDN2,_(DQ1B))
FPGAIO_A9: U3.66(IO,_RUP2,_(DQ1B))
FPGAIO_A10: U3.65(IO,_VREFB4N1)
FPGAIO_A11: U3.64(IO)
FPGAIO_A12: U3.61(IO,_DIFFIO_B23p)
FPGAIO_A13: U3.60(IO,_DIFFIO_B22n,_(DQ1B))
FPGAIO_A14: U3.59(IO,_DIFFIO_B22p,_(DQ1B))
FPGAIO_A15: U3.58(IO,_DIFFIO_B21p,_(DQ1B))
FPGAIO_A16: U3.51(IO,_DIFFIO_B18n,_(DQ1B))
FPGAIO_A17: U3.50(IO,_DIFFIO_B18p,_(DQ1B))
FPGAIO_A18: U3.49(IO,_(DQ1B))
FPGAIO_A19: U3.46(IO,_VREFB3N0)
FPGAIO_A20: U3.44(IO,_PLL1_CLKOUTn)
FPGAIO_A21: U3.43(IO,_PLL1_CLKOUTp)
FPGAIO_A22: U3.42(IO,_(DQS1B/CQ1B#,CDPCLK2))
FPGAIO_A23: U3.39(IO,_VREFB3N1)
FPGAIO_A24: U3.32(IO,_RUP1)
FPGAIO_A25: U3.33(IO,_RDN1)
FPGAIO_B0: U3.103(IO,_DIFFIO_R16p,_(CLKUSR))
FPGAIO_B1: U3.104(IO,_DIFFIO_R15n,_(DQS0R/CQ1R,DPCLK7))
FPGAIO_B2: U3.105(IO,_VREFB6N0)
FPGAIO_B3: U3.106(IO,_DIFFIO_R2n,_(PADD20))
FPGAIO_B4: U3.110(IO,_DIFFIO_T30p,_(DQS0T/CQ1T,CDPCLK6))
FPGAIO_B5: U3.111(IO,_VREFB7N0)
FPGAIO_B6: U3.112(IO,_PLL2_CLKOUTn)
FPGAIO_B7: U3.113(IO,_PLL2_CLKOUTp)
FPGAIO_B8: U3.114(IO,_RUP4,_(DQ1T))
FPGAIO_B9: U3.115(IO,_RDN4,_(DQ1T))
FPGAIO_B10: U3.119(IO,_VREFB7N1)
FPGAIO_B11: U3.120(IO,_DIFFIO_T23n,_(PADD3),_(DQ1T))
FPGAIO_B12: U3.121(IO,_DIFFIO_T21p,_(PADD4))
FPGAIO_B13: U3.125(IO,_DIFFIO_T17p,_(PADD12))
FPGAIO_B14: U3.132(IO,_DIFFIO_T12n,_(DATA2),_(DQ1T))
FPGAIO_B15: U3.133(IO,_DIFFIO_T12p,_(DATA3),_(DQ1T))
FPGAIO_B16: U3.134(IO,_DIFFIO_T11n,_(PADD18))
FPGAIO_B17: U3.135(IO,_DIFFIO_T11p,_(DATA4),_(DQ1T))
FPGAIO_B18: U3.136(IO,_VREFB8N0)
FPGAIO_B19: U3.137(IO,_(DATA5),_(DQ1T))
FPGAIO_B20: U3.141(IO,_VREFB8N1)
FPGAIO_B21: U3.142(IO,_DIFFIO_T2p,_(DATA12),_(DQS1T/CQ1T#,CDPCLK7))
LED0: U3.143(IO,_PLL3_CLKOUTn,_(DQ1T))
LED1: U3.144(IO,_PLL3_CLKOUTp,_(DM1T))
LED2: U3.7(IO,_VREFB1N0)
LED3: U3.10(IO,_(DQS0L/CQ1L,DPCLK0))
SW0: U3.11(IO,_VREFB1N1)
SW1: U3.28(IO,_VREFB2N0)
SW2: U3.30(IO,_DIFFIO_L19p,_(DQS1L/CQ1L#,DPCLK1))
SW3: U3.31(IO,_VREFB2N1)
NetC53_1: U3.13(IO,_(DATA0)) ; port CONF_IO.DATA0
NetC54_1: U3.6(IO,_DIFFIO_L4n,_(DATA1,ASDO)) ; port CONF_IO.ASDO
NetC55_1: U3.8(IO,_DIFFIO_L6p,_(FLASH_nCE,nCSO)) ; port CONF_IO.nCSO

Not connected (* = marked no-connect by the designer): U3 80(IO,_VREFB5N1)

### Buses and harness runs
bus FPGAIO_A[2..27] = port FPGAIO_A[2..27]
bus FPGAIO_B[0..21]
bus LED[0..3] = port LED[0..3]
bus SW[0..3] = port SW[0..3]

### Notes on the sheet
- 8
- 10
- 12
- 7
- 6
- 5
- Title
- Size:
- Date:
- A4
- Number:
- Time:
- Revision:
- Sheet
- of
- File:
- (in symbol EP4CE15E22C8N, part A) BANK 1
- (in symbol EP4CE15E22C8N, part B) BANK 2
- (in symbol EP4CE15E22C8N, part C) BANK 3
- (in symbol EP4CE15E22C8N, part D) BANK 4
- (in symbol EP4CE15E22C8N, part E) BANK 5
- (in symbol EP4CE15E22C8N, part F) BANK 6
- (in symbol EP4CE15E22C8N, part G) BANK 7
- (in symbol EP4CE15E22C8N, part H) BANK 8

### Library data of the parts
U3 = EP4CE15E22C8N: as U3 on sheet FPGA_Conf; DatasheetVersion: ver1.6, Nov-2011; PackageVersion: ver1.0, Jun-2011; PackageReference: EQFP144_A-165_D2-67; PackageDescription: 144-Pin Plastic Enhanced Quad Flat Pack (EQFP) - Wire Bond - A:1.65 - D2:6.7; Code_JEDEC: MS-026-BFB-HD; ComponentLink1Description: Manufacturer URL; ComponentLink1URL: http://www.altera.com/; ComponentLink2Description: Handbook; ComponentLink2URL: http://www.altera.com/literature/hb/cyclone-iv/cyclone4-handbook.pdf; ComponentLink3Description: Pinout; ComponentLink3URL: http://www.altera.com/literature/lit-dp.jsp?category=cyc%204&showspreadsheet=y; ComponentLink4Description: Package Specification; ComponentLink4URL: http://www.altera.com/devicepackaging/04R00221-02.pdf

## Sheet OSC.SchDoc: OSCILATOR
size A4; DocumentNumber: 11; SheetNumber: 11; SheetTotal: 18
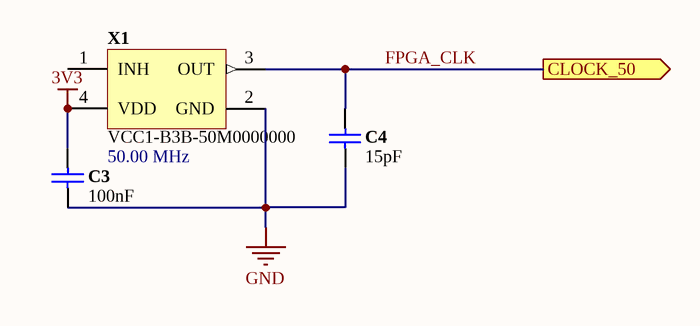
[diagram p16: OSC.SchDoc]

### Parts
C3  100nF  [0805C-GENERIC]
C4  15pF  [0805C-GENERIC]
X1  VCC1-B3B-50M0000000  Frequency: 50.00 MHz  [HOSC-L500HW320H105-4_2]

### Ports
CLOCK_50 (out)

### Nets
3V3: C3.1 X1.4(VDD)
GND: C3.2 C4.2 X1.2(GND)
FPGA_CLK: C4.1 X1.3(OUT) ; port CLOCK_50

Not connected (* = marked no-connect by the designer): X1 1(INH)

### Notes on the sheet
- Title
- Size:
- Date:
- A4
- Number:
- Time:
- Revision:
- Sheet
- of
- File:

### Library data of the parts
C3 C4 = D-101-0027: as C10 on sheet PSU_3V3_LD29300; Dielectric: X7R; Mounting Technology: Surface Mount; Rated Voltage: 10 V; Status: Production; Technology: Ceramic; Tolerance: 10 %; Category: Capacitor
  C3: Capacitance: 100nF
  C4: Capacitance: 15pF
X1 = OSC-4: 50 MHz Oscillator, 3.3V, 15pF; PartNumber: HCX-C2-20M; DefaultDesignator: X?; Class: Oscillators; Output: CMOS; Supply Voltage: 3V3; ComponentLink1Description: Datasheet; ComponentLink1URL: http://www.hongkongcrystal.com/upload/product/original/347881837473.pdf; ComponentLink2Description: Manufacturer; ComponentLink2URL: http://global.kyocera.com/; Type: XO (Standard)